# EasyEDA Pro project 15P1D_EDA.eprj

# Schematic SCH

## Sheets
1 P1: Board Name: B1; Create Date: 2024-03-08; Page Name: P1; Project Name: 15P1D_EDA; Schematic Name: SCH; Update Date: 2024-11-08; Company: EDA设计与开发; Page Size: A4; Version: V1.0
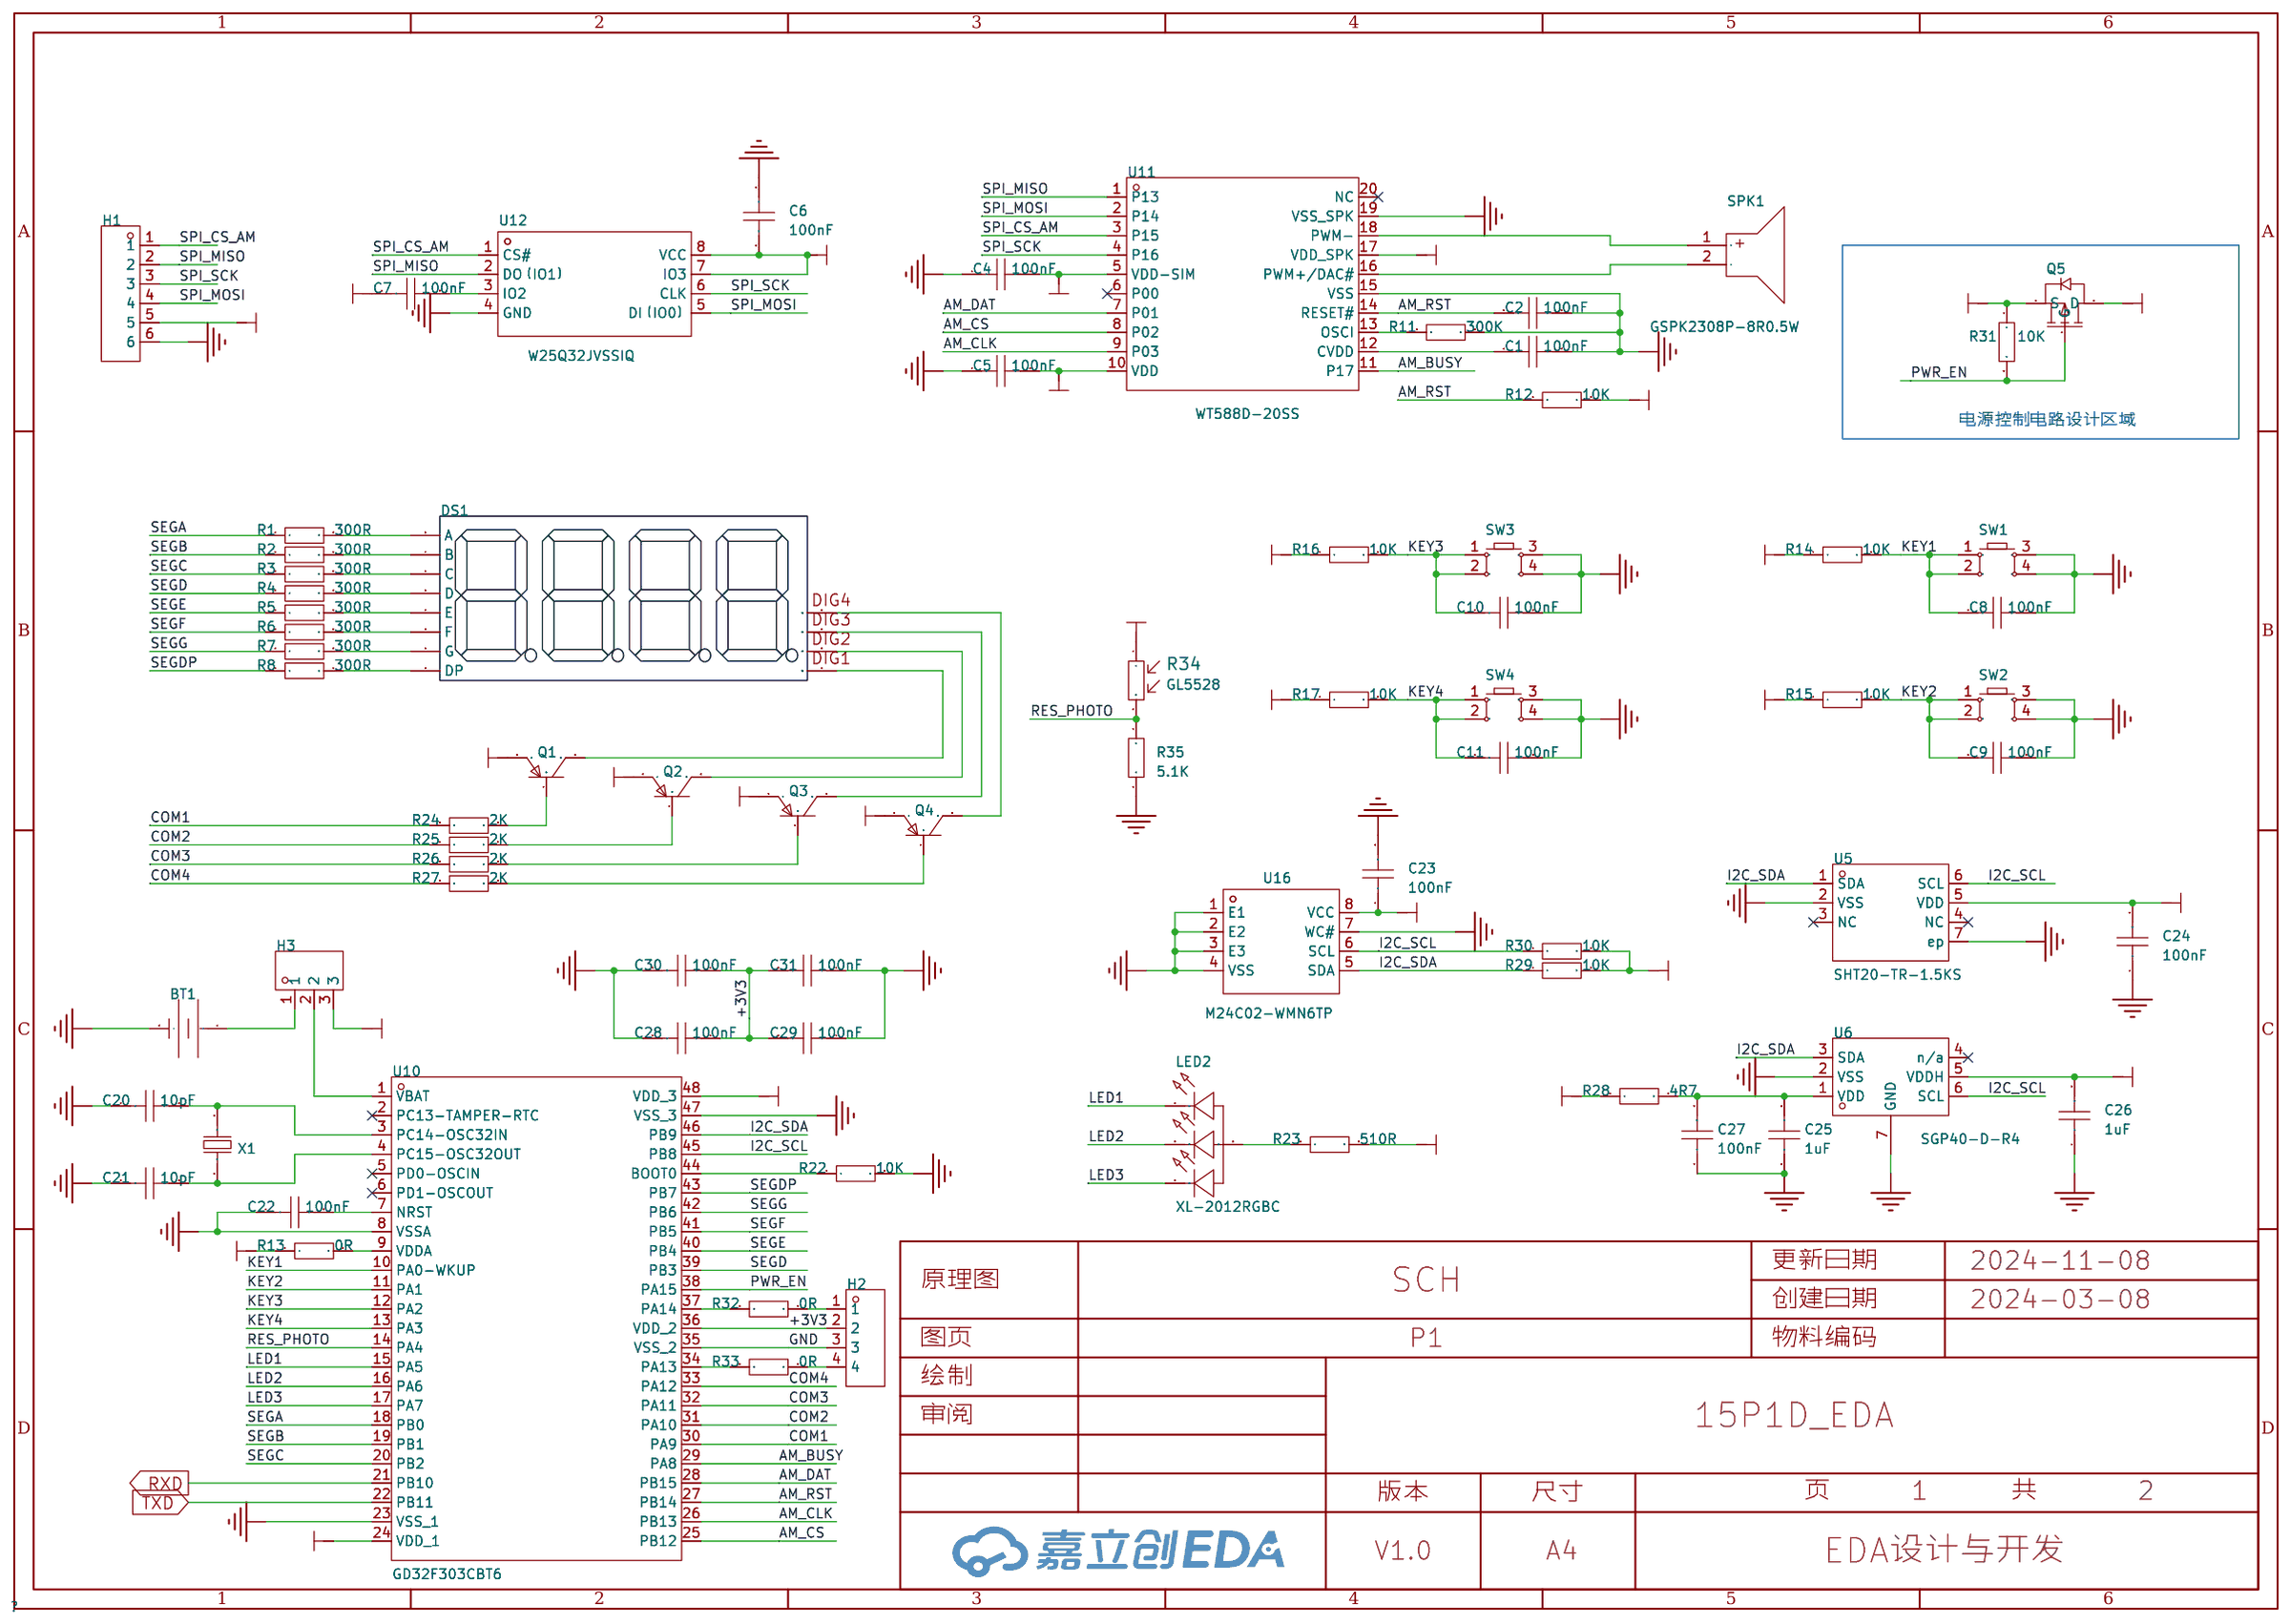
[diagram p0: P1]
2 P2: Create Date: 2024-03-12; Page Name: P2; Update Date: 2024-03-21; Company: 嘉立创EDA
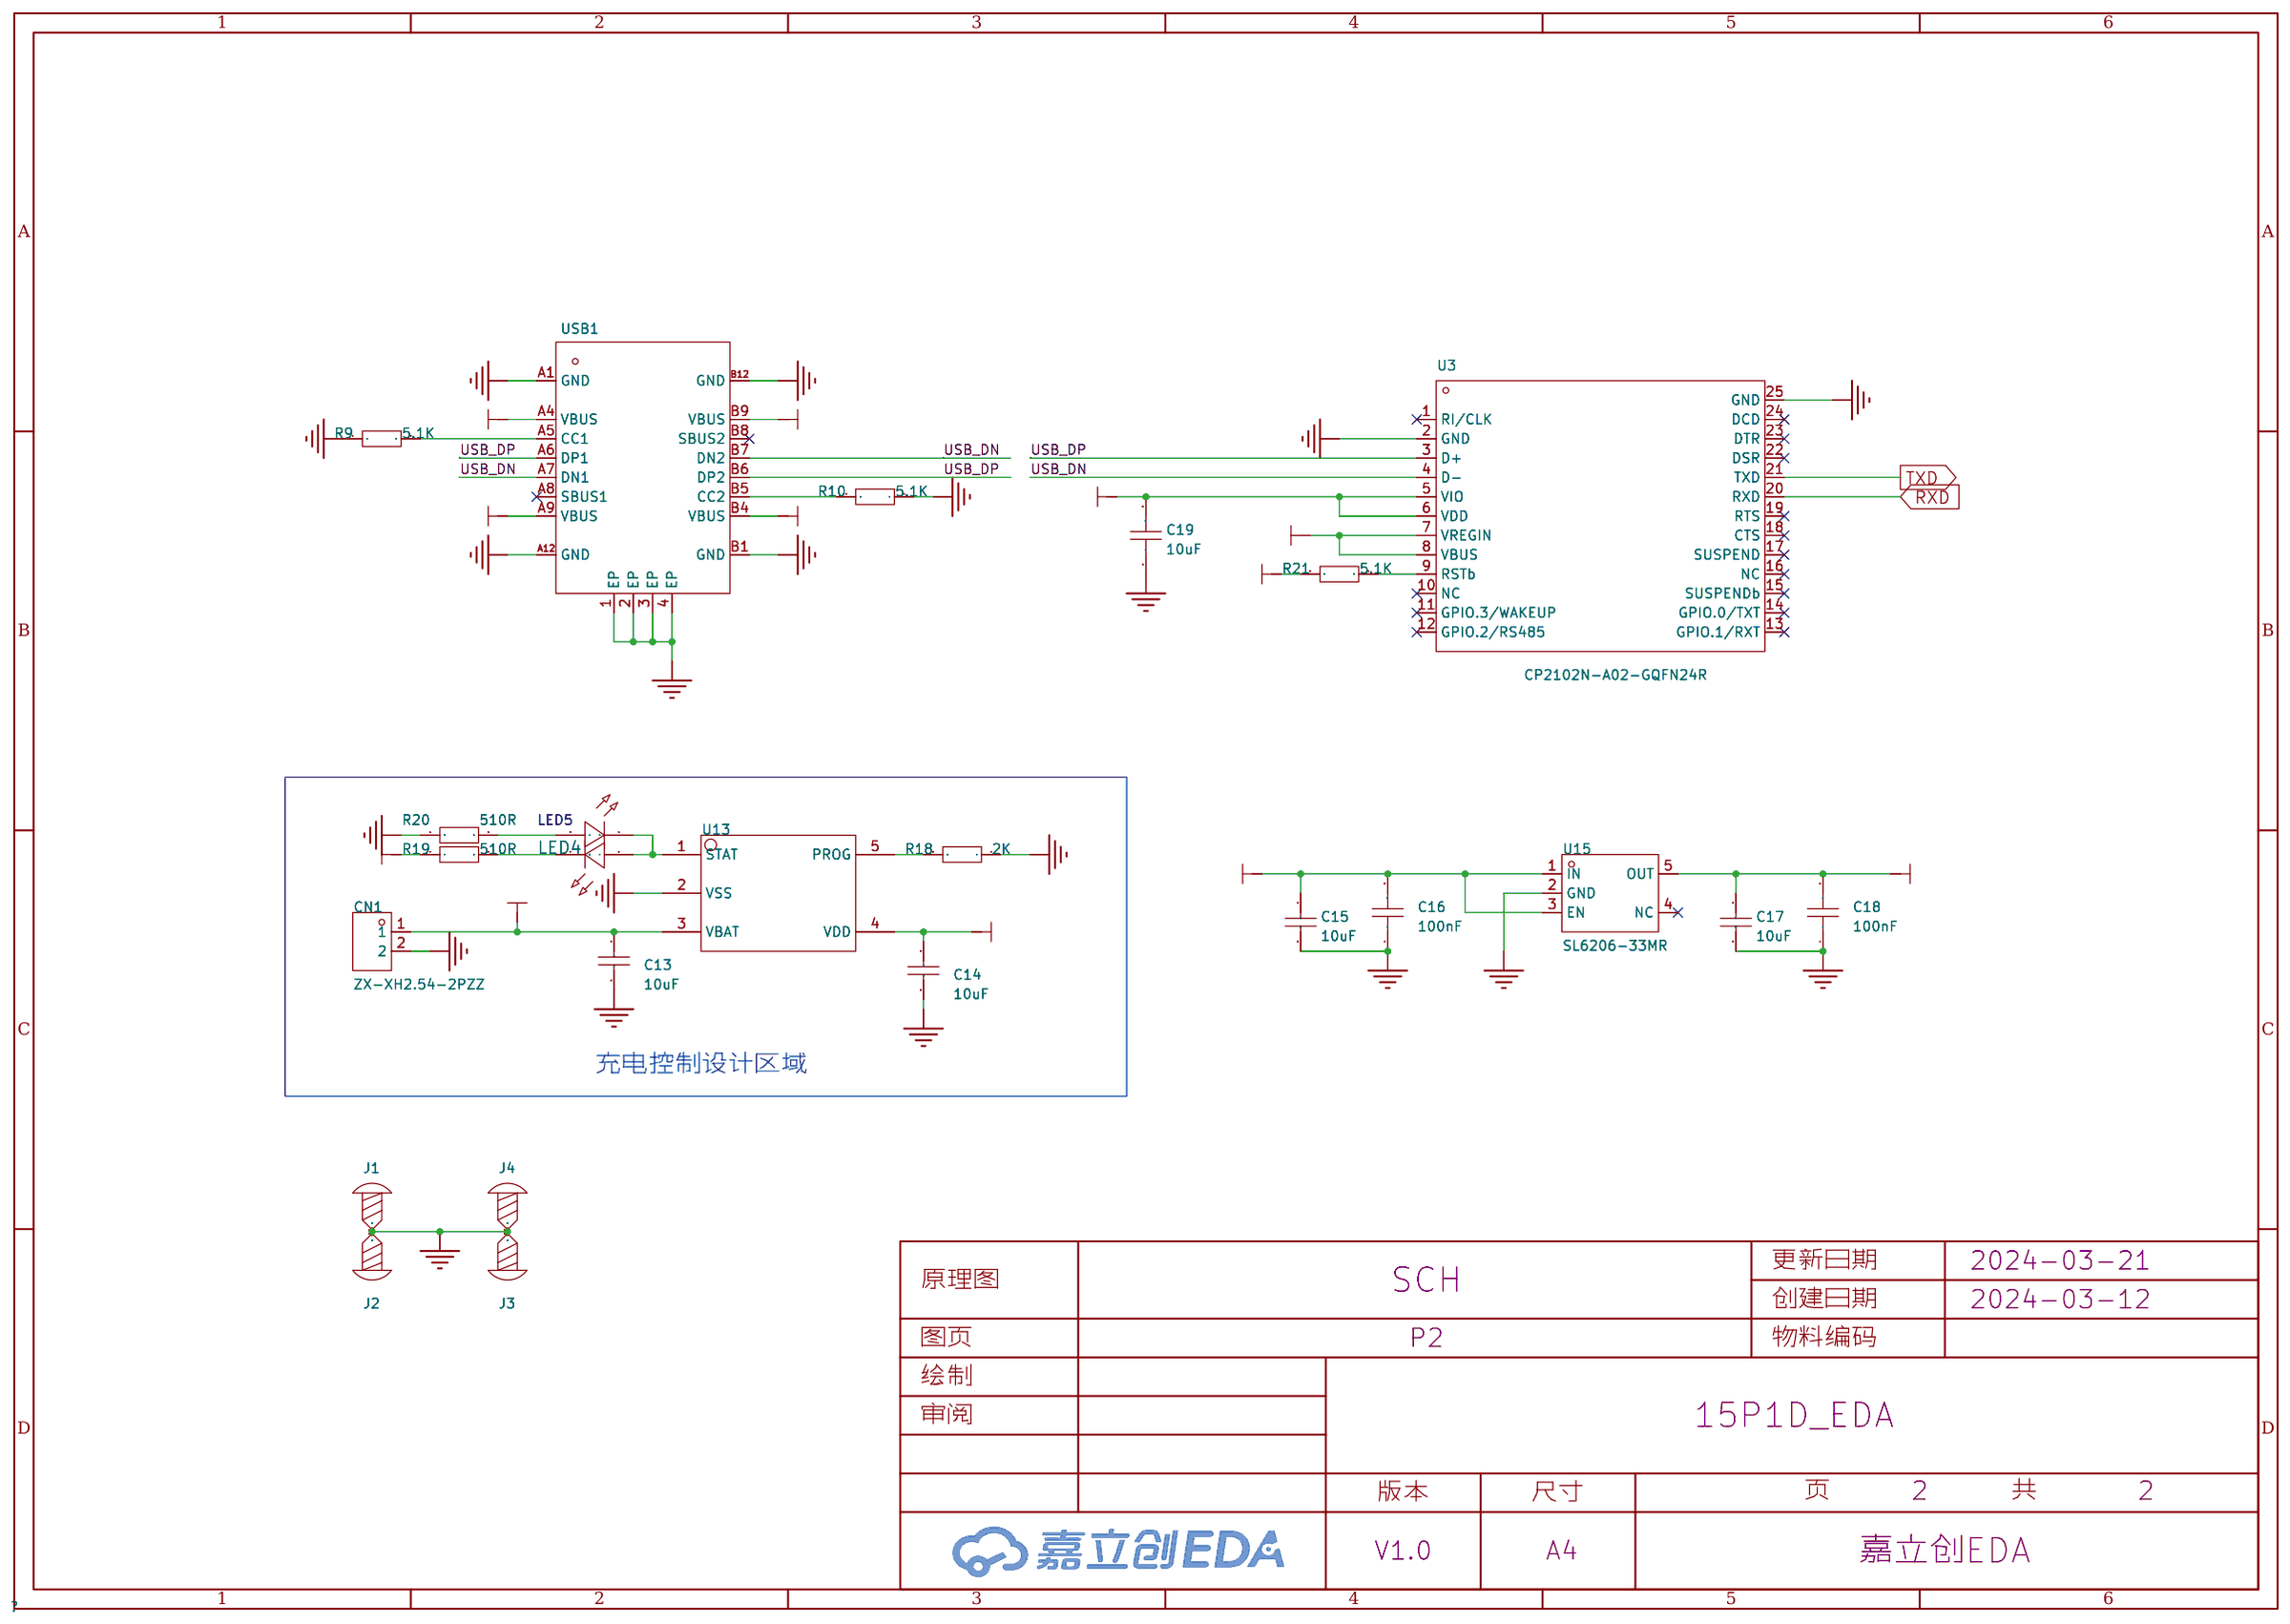
[diagram p1: P2]

## Parts
sheet P1
BT1  BS-12-B3AA003  [BAT-SMD_BS-12-B3AA011]
C1  100nF  [C0805]
C2  100nF  [C0805]
C4  100nF  [C0805]
C5  100nF  [C0805]
C6  100nF  [C0805]
C7  100nF  [C0805]
C8  100nF  [C0805]
C9  100nF  [C0805]
C10  100nF  [C0805]
C11  100nF  [C0805]
C20  10pF  [C0805]
C21  10pF  [C0805]
C22  100nF  [C0805]
C23  100nF  [C0805]
C24  100nF  [C0805]
C25  1uF  [C0805]
C26  1uF  [C0805]
C27  100nF  [C0805]
C28  100nF  [C0805]
C29  100nF  [C0805]
C30  100nF  [C0805]
C31  100nF  [C0805]
DS1  -  [LED-SEG-TH_FJ5461AH]
H1  -  [HDR-TH_6P-P2.54-V-F]
H2  -  [HDR-TH_4P-P2.54-V-F]
H3  Jumper3  [HDR-TH_3P-P2.54-V-M-A]
LED2  XL-2012RGBC  [LED-SMD_4P-L2.0-W1.3-BR]
Q1  -  [S8550P_SOT]
Q2  -  [S8550P_SOT]
Q3  -  [S8550P_SOT]
Q4  -  [S8550P_SOT]
Q5  -  [AO3401A_SOT-23-3]
R1  300R  [R0805]
R2  300R  [R0805]
R3  300R  [R0805]
R4  300R  [R0805]
R5  300R  [R0805]
R6  300R  [R0805]
R7  300R  [R0805]
R8  300R  [R0805]
R11  300K  [R0805]
R12  10K  [R0805]
R13  0R  [R0805]
R14  10K  [R0805]
R15  10K  [R0805]
R16  10K  [R0805]
R17  10K  [R0805]
R22  10K  [R0805]
R23  510R  [R0805]
R24  2K  [R0805]
R25  2K  [R0805]
R26  2K  [R0805]
R27  2K  [R0805]
R28  4R7  [R0805]
R29  10K  [R0805]
R30  10K  [R0805]
R31  10K  [R0805]
R32  0R  [R0805]
R33  0R  [R0805]
R34  GL5528  [RES-TH_L5.1-W4.3-P3.40-D0.5]
R35  5.1K  [R0805]
SPK1  GSPK2308P-8R0.5W  [SPK-TH_BD23.0-P10.00-D0.8-L-RD]
SW1  -  [Key_SMD_12x12x7.3]
SW2  -  [Key_SMD_12x12x7.3]
SW3  -  [Key_SMD_12x12x7.3]
SW4  -  [Key_SMD_12x12x7.3]
U5  SHT20-TR-1.5KS  [DFN-6_L3.0-W3.0-P0.95-TR-EP]
U6  SGP40-D-R4  [DFN-6_L2.4-W2.4-P0.80-TL-EP]
U10  GD32F303CBT6  [LQFP-48_L7.0-W7.0-P0.50-LS9.0-BL]
U11  WT588D-20SS  [SSOP-20_L7.2-W5.3-P0.65-LS7.8-BL]
U12  W25Q32JVSSIQ  [SOIC-8_L5.3-W5.3-P1.27-LS8.0-BL]
U16  M24C02-WMN6TP  [SOIC-8_L4.9-W3.9-P1.27-LS6.0-BL]
X1  32.768kHz  [FC-135R_L3.2-W1.5]
sheet P2
C13  10uF  [C1206]
C14  10uF  [C1206]
C15  10uF  [C1206]
C16  100nF  [C0805]
C17  10uF  [C1206]
C18  100nF  [C0805]
C19  10uF  [C0805]
CN1  ZX-XH2.54-2PZZ  [CONN-TH_2P-P2.50_HX25003-2A]
J1  -  [M2螺丝]
J2  -  [M2螺丝]
J3  -  [M2螺丝]
J4  -  [M2螺丝]
LED4  -  [LED_0805]
LED5  -  [LED_0805]
R9  5.1K  [R0805]
R10  5.1K  [R0805]
R18  2K  [R0805]
R19  510R  [R0805]
R20  510R  [R0805]
R21  5.1K  [R0805]
U3  CP2102N-A02-GQFN24R  [QFN-24_L4.0-W4.0-P0.50-TL-EP2.6]
U13  -  [SOP_BCON]
U15  SL6206-33MR  [SOT-23-5_L2.9-W1.6-P0.95-LS2.8-BL]
USB1  -  [USB_TYPE-C-16P]

## Library data of the parts
BT1 = BS-12-B3AA003: 连接器类型:电池底座;适用电池规格:CR1220;工作温度范围:-25℃~+85℃;; Supplier Part: C964723; Manufacturer: MYOUNG(美阳); Supplier Footprint: SMD; JLCPCB Part Class: 扩展库; Datasheet: https://atta.szlcsc.com/upload/public/pdf/source/20201218/C964723_733B638E287393F86295A2A4DAE43C75.pdf; Supplier: LCSC; Connector Type: 电池底座; Battery Type: CR1220; Operating Temperature Range: -25℃~+85℃
C1 C2 C4-C11 C16 C18-C31 = CAP_0805: Supplier Footprint: 0805
DS1 = LED_SEG_TH_0.56x4: Supplier Footprint: 插件
H1 = HDR-F_2.54_1x6P: Supplier Part: C40877; Supplier Footprint: 插件
H2 = HDR-F_2.54_1x4P: Supplier Part: C2718488; Supplier Footprint: 插件
H3 = Jumper3: Supplier Part: C2940050; Supplier Footprint: HDR-TH-3P-2.54mm; JLCPCB Part Class: 扩展库; Supplier: LCSC
LED2 = XL-2012RGBC: 发光颜色:RGB三色;功率:80mW；80mW；55mW;正向电流:25mA;主波长:619nm~624nm；463nm~466nm；524nm~527nm;二极管配置:-;透镜颜色:无色透明透镜;色温:-;发光角度:120°;载带方式:正贴;工作温度:-30℃~+85℃;; Supplier Part: C965848; Manufacturer: XINGLIGHT(成兴光); Supplier Footprint: 0805; JLCPCB Part Class: 扩展库; Datasheet: https://atta.szlcsc.com/upload/public/pdf/source/20221102/35E310354F68AE1BCFC07B93F5E395D6.pdf; Supplier: LCSC; Emitted Color: RGB三色; Power Dissipation: 80mW；80mW；55mW; Forward Current: 25mA; Dominant Wavelength: 619nm~624nm；463nm~466nm；524nm~527nm; Peak Wavelength: 624nm；528nm；469nm; Lens Color: 无色透明透镜; Viewing Angle: 120°; Mounting Sytle: 正贴; Operating Temperature: -30℃~+85℃
Q1-Q4 = S8550_SOT_PNP: Supplier Footprint: SOT-23
Q5 = AO3401A_P: Supplier Footprint: SOT-23-3L; Supplier Part: C15127
R1-R33 R35 = Res_0805: Supplier Footprint: 0805
R34 = GL5528: 暗电阻:1MΩ;亮电阻 @ 10Lux:8kΩ~20kΩ;光谱峰值(波长):540nm;; LCSC Part Name: 亮电阻:8kΩ~20kΩ 暗电阻:1MΩ; Supplier Part: C125627; Manufacturer: 森霸; Supplier Footprint: 插件,P=3mm; JLCPCB Part Class: 扩展库; Datasheet: https://atta.szlcsc.com/upload/public/pdf/source/20230427/842A99E3D53A83729D7968886D4EFCBB.pdf; Supplier: LCSC; Dark Resistance: 1MΩ; Illuminated Resistance @ 10Lux: 8kΩ~20kΩ; Applied Voltage: 150V; Spectral Peak: 540nm
SPK1 = GSPK2308P-8R0.5W: Supplier Part: C530532; Manufacturer: INGHAi(赢海); JLCPCB Part Class: 扩展库; Datasheet: https://atta.szlcsc.com/upload/public/pdf/source/20200723/C530532_3DB1F973601B36F20FBCCA52751811A3.pdf; Supplier: LCSC
SW1-SW4 = Key_SMD_12x12x7.3: Supplier Footprint: SMD
U5 = SHT20-TR-1.5KS: 接口类型:I2C;; LCSC Part Name: 1-100706-01; Supplier Part: C53865; Manufacturer: Sensirion(瑞士盛思锐); Supplier Footprint: DFN-6-EP(3x3); JLCPCB Part Class: 扩展库; Datasheet: https://atta.szlcsc.com/upload/public/pdf/source/20151012/1457707445424.pdf; Supplier: LCSC; Interface Type: I2C; Supply Voltage: 2.1V~3.6V
U6 = SGP40-D-R4: 气体类型:空气质量;精度:-;; LCSC Part Name: 3.000.384; Supplier Part: C2874215; Manufacturer: Sensirion(瑞士盛思锐); Supplier Footprint: DFN-6-EP(2.4x2.4); JLCPCB Part Class: 扩展库; Datasheet: https://atta.szlcsc.com/upload/public/pdf/source/20231011/67A6038984BE66B07B1FF2325C50691F.pdf; Supplier: LCSC; Type: 空气质量; Operating Temperature: -10℃~+50℃
U10 = GD32F303CBT6_C3013779: CPU内核:CM4;程序存储容量:128KB;RAM总容量:32KB;GPIO端口数量:37;工作电压范围:-;CPU最大主频:120MHz;程序存储器类型:FLASH;; Supplier Part: C3013779; Manufacturer: GigaDevice(兆易创新); Supplier Footprint: LQFP-48(7x7); JLCPCB Part Class: 扩展库; Datasheet: https://atta.szlcsc.com/upload/public/pdf/source/20220624/E1A57ED816B162D6D1424864911A792F.pdf; Supplier: LCSC; CPU Core: CM4; Program Storage Size: 128KB; RAM Size: 32KB; GPIO Ports Number: 37; CPU Maximum Speed: 120MHz; Program Memory Type: FLASH; ADC (Bit): 12bit; DAC (Bit): 12bit; 16Bit Timer: 7; CAN: 1; UART/USART: 3; I2C: 2; I2S: 2; SPI: 3; Peripheral/Function: 看门狗；RTC实时时钟; Watchdog: 有; Real-Time Clock: 有
U11 = WT588D-20SS: 高品质语音芯片; Supplier Part: C87498; Manufacturer: WT(唯创知音); Supplier Footprint: SSOP-20-208mil; JLCPCB Part Class: 扩展库; Datasheet: https://atta.szlcsc.com/upload/public/pdf/source/20161217/1481939141189.pdf; Supplier: LCSC
U12 = W25Q32JVSSIQ_C82344: 接口类型:SPI;存储容量:32Mbit;; Supplier Part: C82344; Manufacturer: WINBOND(华邦); Supplier Footprint: SOIC-8-208mil; JLCPCB Part Class: 扩展库; Datasheet: https://atta.szlcsc.com/upload/public/pdf/source/20160910/1473490310454.pdf; Supplier: LCSC; Interface Type: SPI; Memory Size: 32Mbit; Supply Voltage: 2.7V~3.6V; Page Programming Time (Tpp): 3ms; Operating Temperature: -40℃~+85℃
U16 = M24C02-WMN6TP: 接口类型:I2C;存储容量:2Kbit;; Supplier Part: C7562; Manufacturer: ST(意法半导体); Supplier Footprint: SOIC-8; JLCPCB Part Class: Extended Part; Datasheet: https://atta.szlcsc.com/upload/public/pdf/source/20140724/1457707167301.pdf; Supplier: LCSC; Interface Type: I2C; Memory Size: 2Kbit; Supply Voltage: 2.5V~5.5V; Operating Temperature: -40℃~+85℃
X1 = Q13FC13500004_C32346: 晶振类型:贴片晶振;频率:32.768kHz;常温频差:±20ppm;外接负载电容:12.5pF;; LCSC Part Name: 32.768kHz ±20ppm 12.5pF; Supplier Part: C32346; Manufacturer: EPSON(爱普生); Manufacturer Part: Q13FC13500004; Supplier Footprint: SMD3215-2P; JLCPCB Part Class: 基础库; Datasheet: https://atta.szlcsc.com/upload/public/pdf/source/20190108/C32346_746D6B07EAF90824457A96480007685F.pdf; Supplier: LCSC; Crystal Type: 贴片晶振; Normal temperature Frequency Tolerance: ±20ppm; External load capacitor: 12.5pF; Equivalent Series Resistance (ESR): 70kΩ; Operating Temperature: -40℃~+85℃
C13-C15 C17 = CL31A106KBHNNNE: 容值:10uF;精度:±10%;额定电压:50V;材质(温度系数):X5R;; LCSC Part Name: 10uF ±10% 50V; Supplier Part: C13585; Manufacturer: SAMSUNG(三星); Supplier Footprint: 1206; JLCPCB Part Class: 基础库; Datasheet: https://atta.szlcsc.com/upload/public/pdf/source/20160218/1457707763339.pdf; Supplier: LCSC; Tolerance: ±10%; Voltage Rated: 50V; Temperature Coefficient: X5R
CN1 = ZX-XH2.54-2PZZ: 插针结构:1x2P;间距:2.54mm;安装方式:直插;参考系列:XH;总PIN数:2P;排数:1;每排PIN数:2;行距:-;额定电流:3A;触头材质:黄铜;触头镀层:锡;工作温度范围:-25℃~+85℃;; Supplier Part: C7429632; Manufacturer: Megastar(兆星); Supplier Footprint: 插件,P=2.54mm; JLCPCB Part Class: 扩展库; Datasheet: https://atta.szlcsc.com/upload/public/pdf/source/20230619/19BA6947230AA44A04D3EDD65E618FD0.pdf; Supplier: LCSC; Pins Structure: 1x2P; Pitch: 2.54mm; Mounting Style: 直插; Reference Series: XH; Number of Pins: 2P; Number of Rows: 1; Number of PINs Per Row: 2; Current Rating (Max): 3A; Contact Material: 黄铜; Contact Plating: 锡; Operating Temperature Range: -25℃~+85℃
J1-J4 = M2螺丝: Supplier Footprint: 插件
LED4 = LED_0805-R: Supplier Footprint: 0805
LED5 = LED_0805-G: Supplier Footprint: 0805
U3 = CP2102N-A02-GQFN24R: 应用功能:USB转UART;接口协议:UART;; Supplier Part: C969151; Manufacturer: SKYWORKS/SILICON LABS(芯科); Supplier Footprint: QFN-24-EP(4x4); JLCPCB Part Class: 扩展库; Datasheet: https://atta.szlcsc.com/upload/public/pdf/source/20201204/C964632_F2B790CC23A72455AEF523510305B30A.pdf; Supplier: LCSC; Applications Function: USB转UART; Protocol: UART; Supply Voltage: 3V~3.6V; Operating Temperature: -40℃~+85℃@(Ta)
U13 = BCON
U15 = SL6206-33MR: 输出类型:-;; Supplier Part: C707122; Manufacturer: Slkor(萨科微); Supplier Footprint: SOT-23-5; JLCPCB Part Class: 扩展库; Datasheet: https://atta.szlcsc.com/upload/public/pdf/source/20200721/C707121_33633D17E61D5DC97F22208BE63A0FB1.pdf; Supplier: LCSC
USB1 = USB_TYPE-C-16P: Supplier Footprint: SMD

## Nets
+3V3: C4.2 C5.2 C6.2 C7.1 C17.2 C18.2 C19.2 C23.1 C28.1 C29.2 C30.1 C31.2 H1.5 H2.2 H3.3 Q1.2(E) Q2.2(E) Q3.2(E) Q4.2(E) Q5.2(S) R12.2 R13.1 R14.1 R15.1 R16.1 R17.1 R21.2 R23.2 R29.2 R30.2 R31.1 R34.1 U3.5(VIO) U3.6(VDD) U10.24(VDD_1) U10.36(VDD_2) U10.48(VDD_3) U11.5(VDD-SIM) U11.10(VDD) U11.17(VDD_SPK) U12.7(IO3) U12.8(VCC) U15.5(OUT) U16.8(VCC)
GND: BT1.2(-) C1.2 C2.2 C4.1 C5.1 C6.1 C8.2 C9.2 C10.2 C11.2 C13.2 C14.1 C15.1 C16.1 C17.1 C18.1 C19.1 C20.1 C21.1 C22.1 C23.2 C24.1 C25.1 C26.1 C27.1 C28.2 C29.1 C30.2 C31.1 CN1.2 H1.6 H2.3 J1.1 J2.1 J3.1 J4.1 R9.1 R10.1 R11.2 R18.1 R20.1 R22.2 R35.2 SW1.3 SW1.4 SW2.3 SW2.4 SW3.3 SW3.4 SW4.3 SW4.4 U3.2(GND) U3.25(GND) U5.2(VSS) U5.7(ep) U6.2(VSS) U6.7(GND) U10.8(VSSA) U10.23(VSS_1) U10.35(VSS_2) U10.47(VSS_3) U11.15(VSS) U11.19(VSS_SPK) U12.4(GND) U13.2(VSS) U15.2(GND) U16.1(E1) U16.2(E2) U16.3(E3) U16.4(VSS) U16.7(WC#) USB1.1(EP) USB1.2(EP) USB1.3(EP) USB1.4(EP) USB1.A1(GND) USB1.A12(GND) USB1.B1(GND) USB1.B12(GND)
VBAT: C13.1 C15.2 C16.2 CN1.1 U13.3(VBAT) U15.1(IN) U15.3(EN)
VBUS: C14.2 R19.1 U3.7(VREGIN) U3.8(VBUS) U13.4(VDD) USB1.A4(VBUS) USB1.A9(VBUS) USB1.B4(VBUS) USB1.B9(VBUS)
+VS: C24.2 C26.2 Q5.3(D) R28.1 U5.5(VDD) U6.5(VDDH)
AM_BUSY: U10.29(PA8) U11.11(P17)
AM_CLK: U10.26(PB13) U11.9(P03)
AM_CS: U10.25(PB12) U11.8(P02)
AM_DAT: U10.28(PB15) U11.7(P01)
AM_RST: C2.1 R12.1 U10.27(PB14) U11.14(RESET#)
COM1: R24.1 U10.30(PA9)
COM2: R25.1 U10.31(PA10)
COM3: R26.1 U10.32(PA11)
COM4: R27.1 U10.33(PA12)
I2C_SCL: R30.1 U5.6(SCL) U6.6(SCL) U10.45(PB8) U16.6(SCL)
I2C_SDA: R29.1 U5.1(SDA) U6.3(SDA) U10.46(PB9) U16.5(SDA)
KEY1: C8.1 R14.2 SW1.1 SW1.2 U10.10(PA0-WKUP)
KEY2: C9.1 R15.2 SW2.1 SW2.2 U10.11(PA1)
KEY3: C10.1 R16.2 SW3.1 SW3.2 U10.12(PA2)
KEY4: C11.1 R17.2 SW4.1 SW4.2 U10.13(PA3)
LED1: LED2.1 U10.15(PA5)
LED2: LED2.2 U10.16(PA6)
LED3: LED2.4 U10.17(PA7)
PWR_EN: Q5.1(G) R31.2 U10.38(PA15)
RES_PHOTO: R34.2 R35.1 U10.14(PA4)
RXD: U3.20(RXD) U10.21(PB10)
SEGA: R1.1 U10.18(PB0)
SEGB: R2.1 U10.19(PB1)
SEGC: R3.1 U10.20(PB2)
SEGD: R4.1 U10.39(PB3)
SEGDP: R8.1 U10.43(PB7)
SEGE: R5.1 U10.40(PB4)
SEGF: R6.1 U10.41(PB5)
SEGG: R7.1 U10.42(PB6)
SPI_CS_AM: H1.1 U11.3(P15) U12.1(CS#)
SPI_MISO: H1.2 U11.1(P13) U12.2(DO（IO1）)
SPI_MOSI: H1.4 U11.2(P14) U12.5(DI（IO0）)
SPI_SCK: H1.3 U11.4(P16) U12.6(CLK)
TXD: U3.21(TXD) U10.22(PB11)
USB_DN: U3.4(D-) USB1.A7(DN1) USB1.B7(DN2)
USB_DP: U3.3(D+) USB1.A6(DP1) USB1.B6(DP2)
$1N1449: DS1.8(DIG3) Q3.3(C)
$1N1467: DS1.1(E) R5.2
$1N1471: DS1.2(D) R4.2
$1N1475: DS1.3(DP) R8.2
$1N1479: DS1.4(C) R3.2
$1N1483: DS1.5(G) R7.2
$1N1487: DS1.11(A) R1.2
$1N1491: DS1.7(B) R2.2
$1N1495: DS1.10(F) R6.2
$1N6161: C1.1 U11.12(CVDD)
$1N6192: R11.1 U11.13(OSCI)
$1N6375: SPK1.1(+) U11.18(PWM-)
$1N6384: SPK1.2(-) U11.16(PWM+/DAC#)
$1N6917: C7.2 U12.3(IO2)
$1N7212: R13.2 U10.9(VDDA)
$1N7925: C20.2 U10.3(PC14-OSC32IN) X1.1
$1N7930: C21.2 U10.4(PC15-OSC32OUT) X1.2
$1N8028: R22.1 U10.44(BOOT0)
$1N8104: LED2.3 R23.1
$1N8256: DS1.12(DIG1) Q1.3(C)
$1N8335: DS1.9(DIG2) Q2.3(C)
$1N8343: DS1.6(DIG4) Q4.3(C)
$1N8477: Q1.1(B) R24.2
$1N8481: Q2.1(B) R25.2
$1N8485: Q3.1(B) R26.2
$1N8489: Q4.1(B) R27.2
$1N8598: C22.2 U10.7(NRST)
$1N9384: C25.2 C27.2 R28.2 U6.1(VDD)
$1N9794: R32.1 U10.37(PA14)
$1N9795: H2.1 R32.2
$1N9824: R33.1 U10.34(PA13)
$1N9825: H2.4 R33.2
$1N10132: BT1.1(+) H3.1
$1N10135: H3.2 U10.1(VBAT)
$2N394: R9.2 USB1.A5(CC1)
$2N397: R10.2 USB1.B5(CC2)
$2N1836: R21.1 U3.9(RSTb)
$2N7002: LED4.2(A) LED5.1(C) U13.1(STAT)
$2N7018: LED5.2(A) R20.2
$2N7022: LED4.1(C) R19.2
$2N7090: R18.2 U13.5(PROG)

Not connected (* = marked no-connect by the designer): U3 1(RI/CLK)* 10(NC)* 11(GPIO.3/WAKEUP)* 12(GPIO.2/RS485)* 13(GPIO.1/RXT)* 14(GPIO.0/TXT)* 15(SUSPENDb)* 16(NC)* 17(SUSPEND)* 18(CTS)* 19(RTS)* 22(DSR)* 23(DTR)* 24(DCD)*; U5 3(NC)* 4(NC)*; U6 4(n/a)*; U10 2(PC13-TAMPER-RTC)* 5(PD0-OSCIN)* 6(PD1-OSCOUT)*; U11 6(P00)* 20(NC)*; U15 4(NC)*; USB1 A8(SBUS1)* B8(SBUS2)*

## Notes on the sheets
sheet 1
- 电源控制电路设计区域
sheet 2
- 充电控制设计区域

# Board PCB
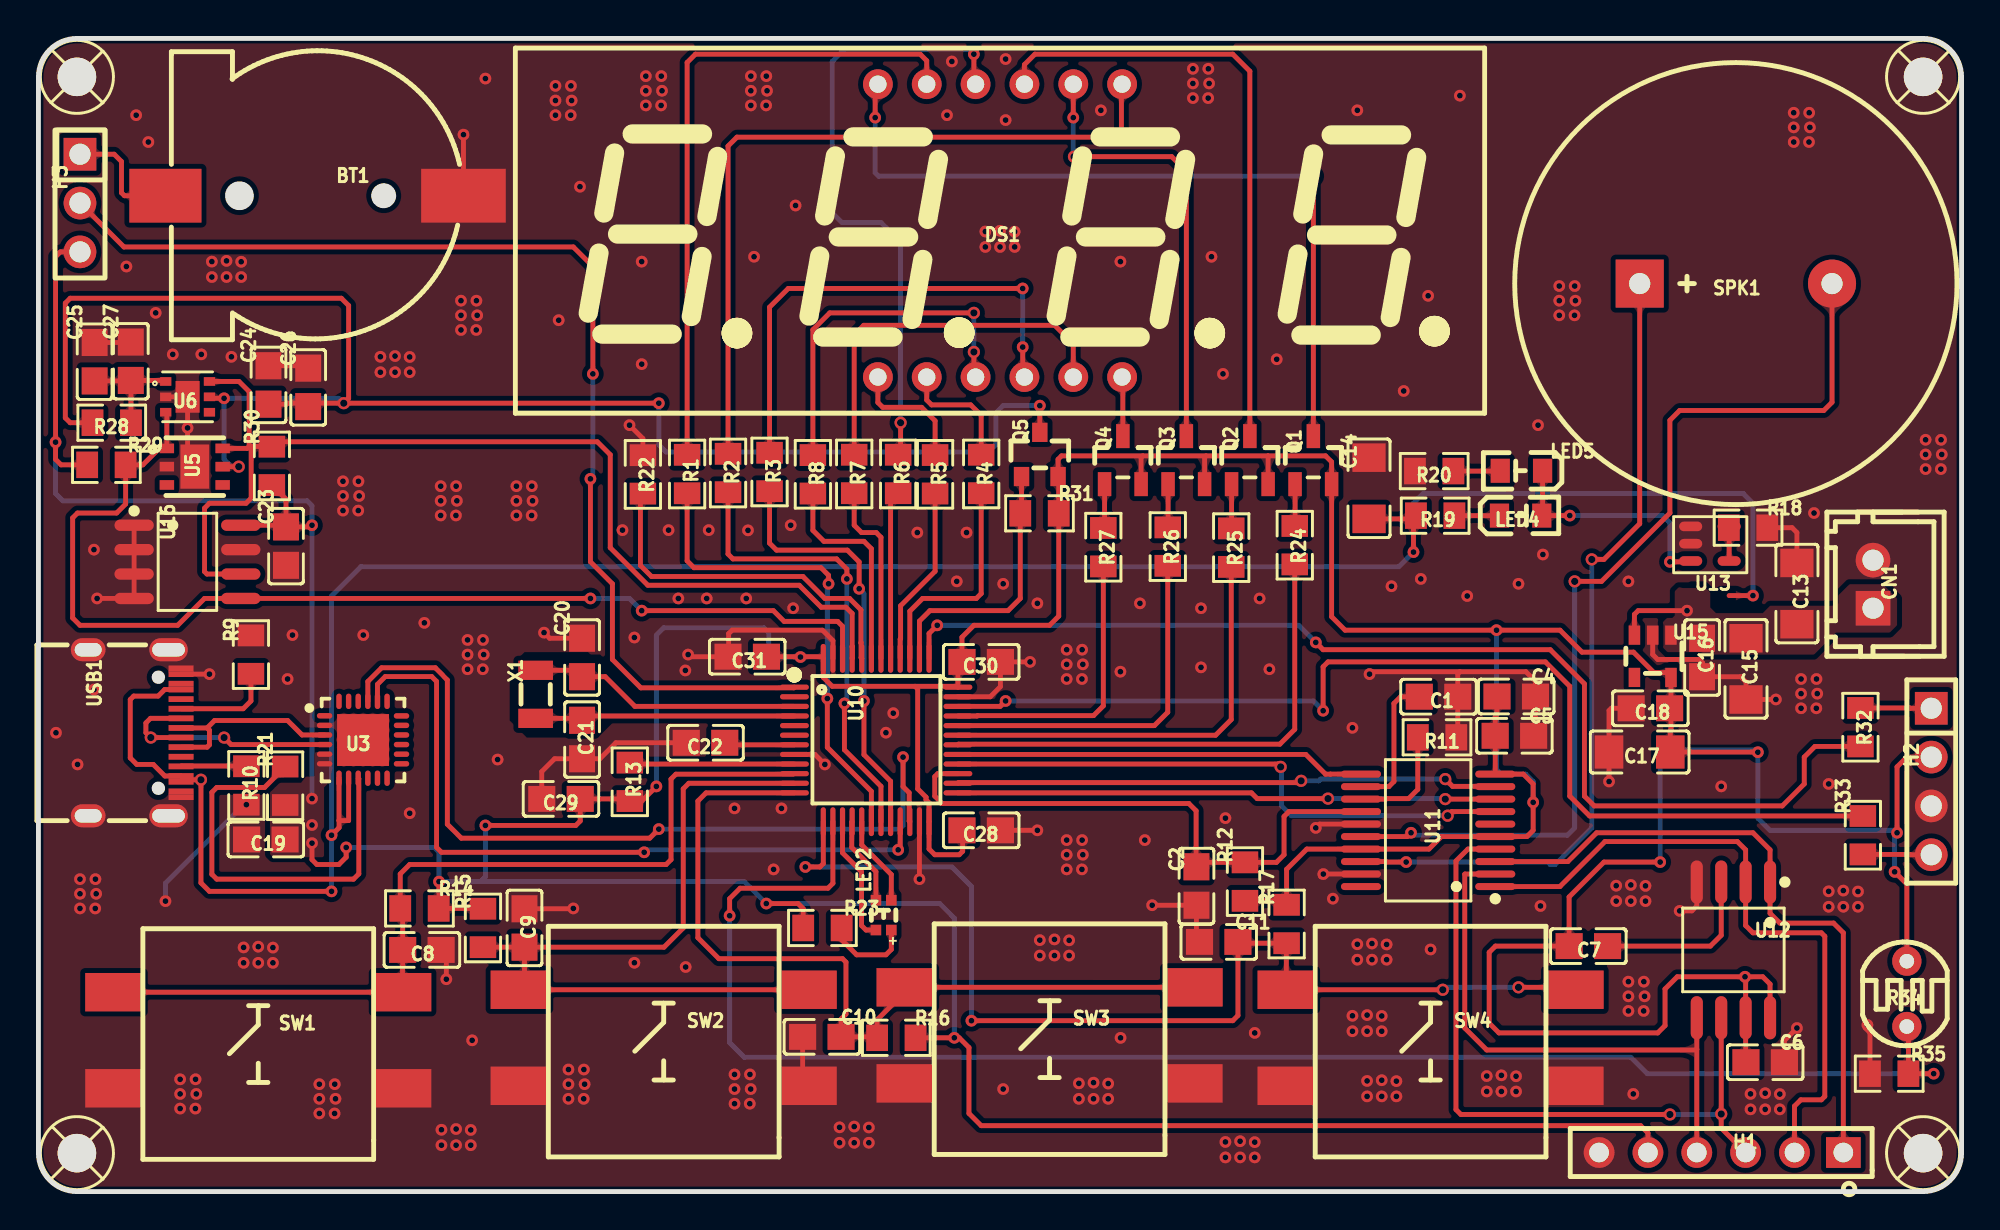
[diagram p2: board, top side]
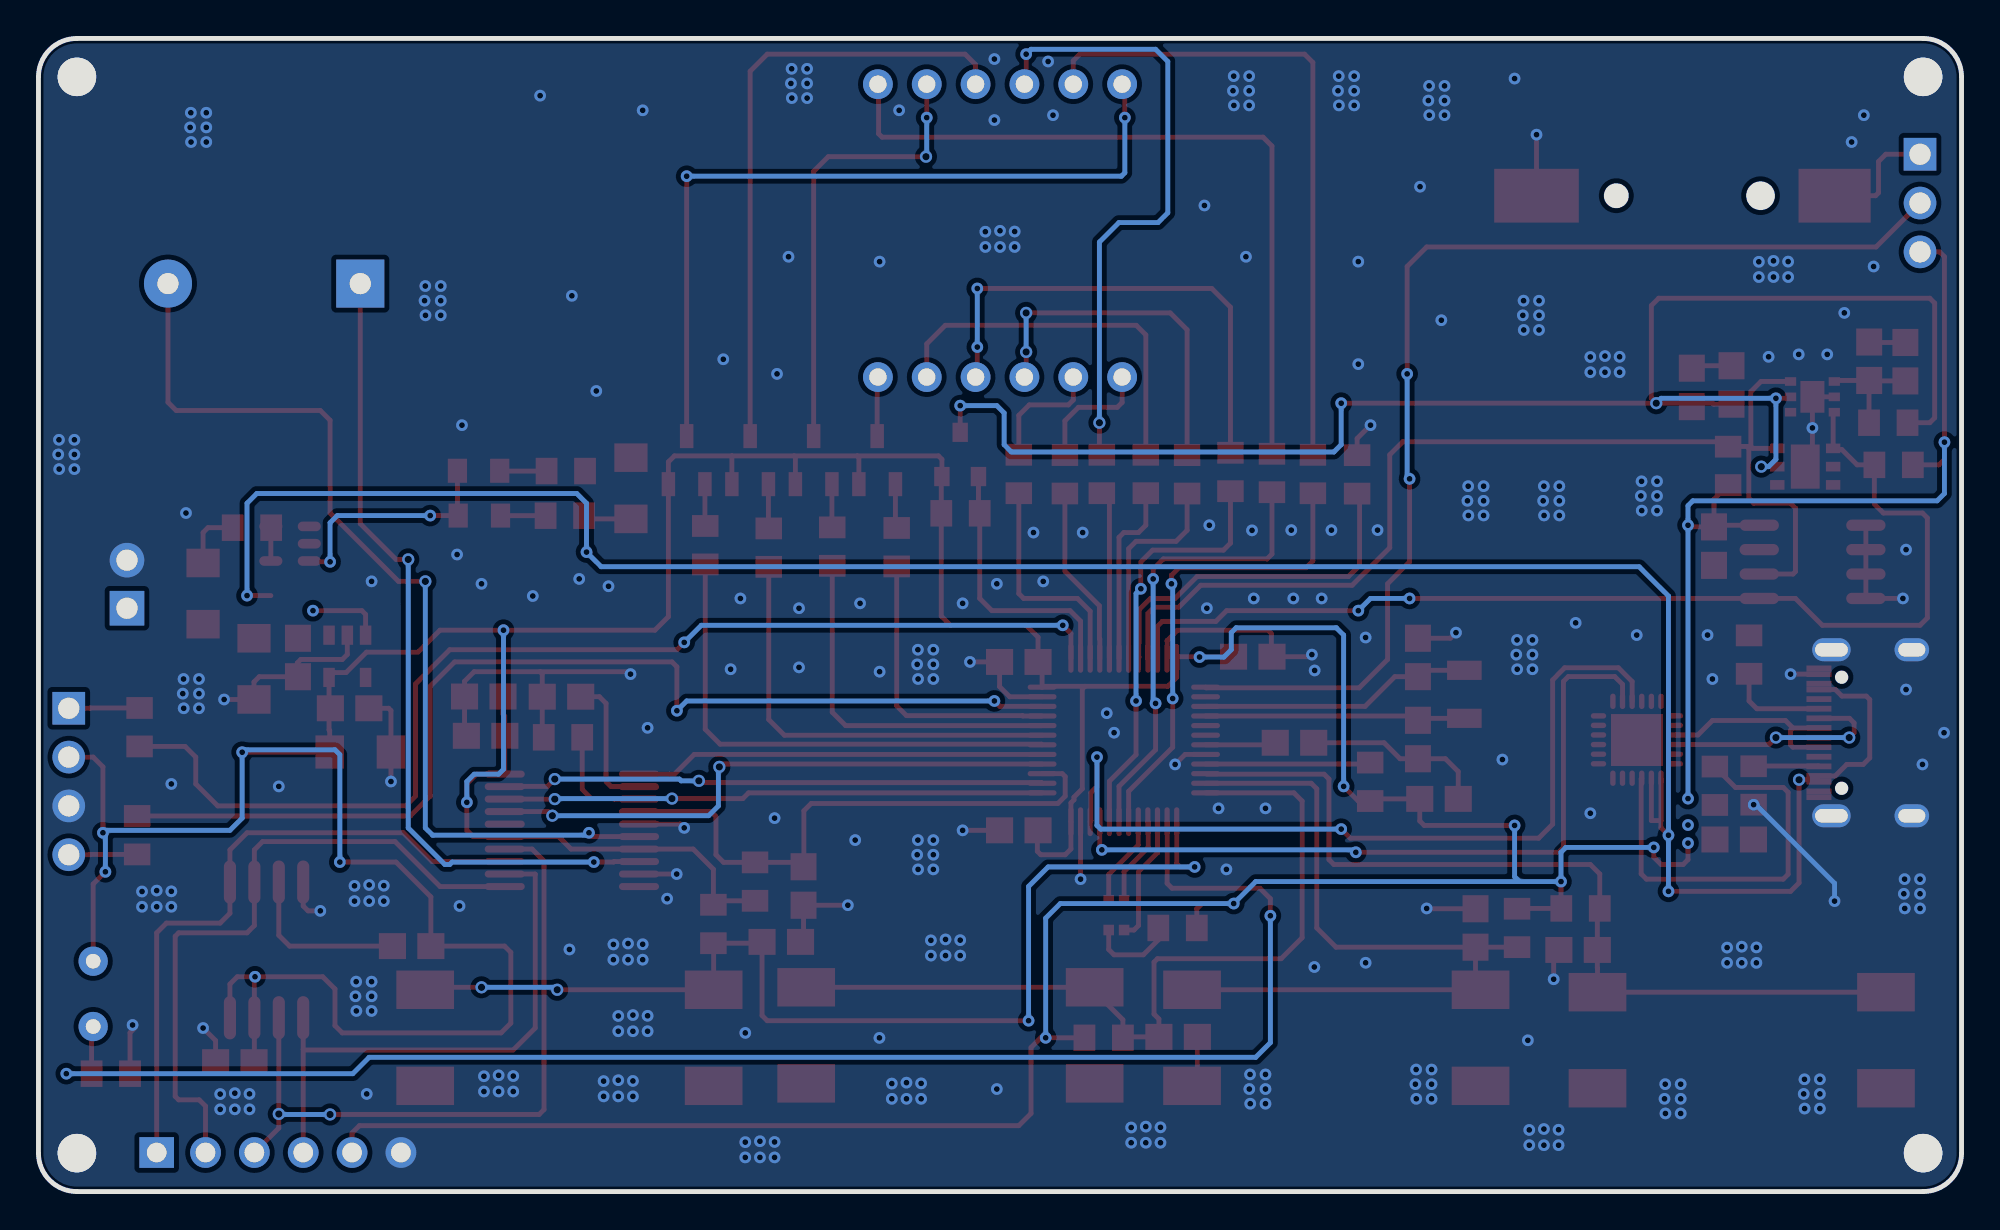
[diagram p3: board, bottom side, seen from below]

Outline 100 x 60 mm; copper layers: Top Layer, Bottom Layer. Coordinates in mm from the lower left corner of the outline.
Outline path: 0,58 0,2 arc(0.59,0.59) 2,0 98,0 arc(99.41,0.59) 100,2 100,58 arc(99.41,59.41) 98,60 2,60 arc(0.59,59.41) 0,58
Stack: Top Layer 0.035mm / Dielectric1 1.51mm FR4 er 4.5 / Bottom Layer 0.035mm

## Design rules (mm)
template: 自定义配置
spacing copperThickness1oz (default): track to track 0.203, other pairs 0.178 to 0.203
spacing copperThickness2oz: track to track 0.203, other pairs 0.152 to 0.3
track width copperThickness1oz (default): min 0.254, default 0.254, max 2.54
track width copperThickness2oz: min 0.203, default 0.254, max 2.54
differential pair differentialPair (default): width min 0.127, default 0.254, max 2.54; gap min 0.152, default 0.152
via viaSize (default): diameter min 0.61, default 0.61, max 0.635; hole min 0.305, default 0.305, max 0.381

## Placement (name value [footprint] x y rotation side)
BT1  BS-12-B3AA003  [BAT-SMD_BS-12-B3AA011]  14.35 51.82 180 top
C1  100nF  [C0805]  72.8 25.75 0 top
C2  100nF  [C0805]  60.22 15.9 270 top
C4  100nF  [C0805]  76.84 25.76 180 top
C5  100nF  [C0805]  76.75 23.72 180 top
C6  100nF  [C0805]  89.79 6.73 180 top
C7  100nF  [C0805]  80.59 12.77 0 top
C8  100nF  [C0805]  19.94 12.57 0 top
C9  100nF  [C0805]  25.27 13.72 90 top
C10  100nF  [C0805]  40.74 8.05 180 top
C11  100nF  [C0805]  61.37 12.99 180 top
C13  10uF  [C1206]  91.44 31.11 90 top
C14  10uF  [C1206]  69.19 36.59 270 top
C15  10uF  [C1206]  88.79 27.2 90 top
C16  100nF  [C0805]  86.51 27.79 90 top
C17  10uF  [C1206]  83.26 22.87 0 top
C18  100nF  [C0805]  83.82 25.15 0 top
C19  10uF  [C0805]  11.82 18.32 0 top
C20  10pF  [C0805]  28.27 27.79 270 top
C21  10pF  [C0805]  28.27 23.52 90 top
C22  100nF  [C0805]  34.69 23.35 0 top
C23  100nF  [C0805]  12.87 33.58 270 top
C24  100nF  [C0805]  11.96 41.97 270 top
C25  1uF  [C0805]  2.92 43.18 270 top
C26  1uF  [C0805]  14.03 41.84 270 top
C27  100nF  [C0805]  4.8 43.2 270 top
C28  100nF  [C0805]  49.02 18.8 0 top
C29  100nF  [C0805]  27.17 20.43 0 top
C30  100nF  [C0805]  49.02 27.56 0 top
C31  100nF  [C0805]  36.86 27.83 0 top
CN1  ZX-XH2.54-2PZZ  [CONN-TH_2P-P2.50_HX25003-2A]  95.4 31.6 90 top
DS1  -  [LED-SEG-TH_FJ5461AH]  50 50 0 top
H1  -  [HDR-TH_6P-P2.54-V-F]  87.5 2.03 180 top
H2  -  [HDR-TH_4P-P2.54-V-F]  98.43 21.34 270 top
H3  Jumper3  [HDR-TH_3P-P2.54-V-M-A]  2.16 51.44 270 top
J1  -  [M2螺丝]  2 2 0 top
J2  -  [M2螺丝]  98 2 0 top
J3  -  [M2螺丝]  98 58 0 top
J4  -  [M2螺丝]  2 58 0 top
LED2  XL-2012RGBC  [LED-SMD_4P-L2.0-W1.3-BR]  43.95 14.38 270 top
LED4  -  [LED_0805]  77.12 35.17 0 top
LED5  -  [LED_0805]  77.06 37.51 180 top
Q1  -  [S8550P_SOT]  66.29 38.1 270 top
Q2  -  [S8550P_SOT]  62.99 38.1 270 top
Q3  -  [S8550P_SOT]  59.69 38.1 270 top
Q4  -  [S8550P_SOT]  56.39 38.1 270 top
Q5  -  [AO3401A_SOT-23-3]  52.07 38.35 270 top
R1  300R  [R0805]  33.73 37.33 90 top
R2  300R  [R0805]  35.86 37.39 90 top
R3  300R  [R0805]  38.02 37.44 90 top
R4  300R  [R0805]  49.02 37.34 90 top
R5  300R  [R0805]  46.62 37.32 90 top
R6  300R  [R0805]  44.7 37.34 90 top
R7  300R  [R0805]  42.42 37.34 90 top
R8  300R  [R0805]  40.27 37.32 90 top
R9  5.1K  [R0805]  11.05 27.94 270 top
R10  5.1K  [R0805]  10.81 21.13 90 top
R11  300K  [R0805]  72.72 23.63 0 top
R12  10K  [R0805]  62.74 16.13 270 top
R13  0R  [R0805]  30.75 21.32 90 top
R14  10K  [R0805]  19.81 14.73 180 top
R15  10K  [R0805]  23.11 13.72 270 top
R16  10K  [R0805]  44.61 8 180 top
R17  10K  [R0805]  64.9 13.92 270 top
R18  2K  [R0805]  88.9 34.54 180 top
R19  510R  [R0805]  72.63 35.17 0 top
R20  510R  [R0805]  72.58 37.49 0 top
R21  5.1K  [R0805]  12.83 21.11 270 top
R22  10K  [R0805]  31.43 37.32 90 top
R23  510R  [R0805]  40.77 13.72 180 top
R24  2K  [R0805]  65.33 33.63 90 top
R25  2K  [R0805]  62.03 33.51 90 top
R26  2K  [R0805]  58.72 33.56 90 top
R27  2K  [R0805]  55.37 33.53 90 top
R28  4R7  [R0805]  3.81 40 0 top
R29  10K  [R0805]  3.53 37.81 180 top
R30  10K  [R0805]  12.14 37.76 270 top
R31  10K  [R0805]  52.05 35.29 180 top
R32  0R  [R0805]  94.74 24.16 90 top
R33  0R  [R0805]  94.87 18.54 270 top
R34  GL5528  [RES-TH_L5.1-W4.3-P3.40-D0.5]  97.16 10.29 0 top
R35  5.1K  [R0805]  96.24 6.13 180 top
SPK1  GSPK2308P-8R0.5W  [SPK-TH_BD23.0-P10.00-D0.8-L-RD]  88.26 47.24 0 top
SW1  -  [Key_SMD_12x12x7.3]  11.43 7.87 180 top
SW2  -  [Key_SMD_12x12x7.3]  32.51 8 180 top
SW3  -  [Key_SMD_12x12x7.3]  52.58 8.13 180 top
SW4  -  [Key_SMD_12x12x7.3]  72.39 8 180 top
U3  CP2102N-A02-GQFN24R  [QFN-24_L4.0-W4.0-P0.50-TL-EP2.6]  16.88 23.51 0 top
U5  SHT20-TR-1.5KS  [DFN-6_L3.0-W3.0-P0.95-TR-EP]  8.13 37.72 90 top
U6  SGP40-D-R4  [DFN-6_L2.4-W2.4-P0.80-TL-EP]  7.75 41.35 0 top
U10  GD32F303CBT6  [LQFP-48_L7.0-W7.0-P0.50-LS9.0-BL]  43.56 23.5 270 top
U11  WT588D-20SS  [SSOP-20_L7.2-W5.3-P0.65-LS7.8-BL]  72.26 18.8 90 top
U12  W25Q32JVSSIQ  [SOIC-8_L5.3-W5.3-P1.27-LS8.0-BL]  88.14 12.57 180 top
U13  -  [SOP_BCON]  85.92 32.81 0 top
U15  SL6206-33MR  [SOT-23-5_L2.9-W1.6-P0.95-LS2.8-BL]  83.94 27.85 180 top
U16  M24C02-WMN6TP  [SOIC-8_L4.9-W3.9-P1.27-LS6.0-BL]  7.75 32.77 270 top
USB1  -  [USB_TYPE-C-16P]  5 24 270 top
X1  32.768kHz  [FC-135R_L3.2-W1.5]  25.85 25.87 270 top

## Footprints (pads in the part's own frame, mm; a bottom-side part is the same pattern mirrored in y, then rotated)
AO3401A_SOT-23-3
  rect 1x0.8 smd: 1(1.15,-0.95) 2(1.15,0.95) 3(-1.15,0)
BAT-SMD_BS-12-B3AA011
  rect 3.75x2.8 smd: 1(7.75,0)
  rect 4.4x2.8 smd: 2(-7.75,0)
C0805
  rect 1.41x1.35 smd: 1(-1,0) 2(1,0)
C1206
  rect 1.485x1.728 smd: 1(-1.593,0) 2(1.593,0)
CONN-TH_2P-P2.50_HX25003-2A
  rect 1.8x1.8 hole 1.1: 1(-1.25,0)
  round 1.8 hole 1.1: 2(1.25,0)
DFN-6_L2.4-W2.4-P0.80-TL-EP
  rect 0.585x0.448 smd: 1(-1.137,0.8) 2(-1.137,0) 3(-1.137,-0.8) 4(1.137,-0.8) 5(1.137,0) 6(1.137,0.8)
  rect 1.25x1.65 smd: 7(0,0)
DFN-6_L3.0-W3.0-P0.95-TR-EP
  rect 0.5x0.75 smd: 1(0.95,1.452) 2(0,1.451) 3(-0.95,1.45) 4(-0.95,-1.452) 5(0,-1.452) 6(0.95,-1.451)
  rect 2.3x1.5 smd: 7(0.004,-0.001)
FC-135R_L3.2-W1.5
  rect 1x1.8 smd: 1(-1.25,0) 2(1.25,0)
HDR-TH_3P-P2.54-V-M-A
  rect 1.7x1.7 hole 1.1: 1(-2.54,0)
  round 1.7 hole 1.1: 2(0,0) 3(2.54,0)
HDR-TH_4P-P2.54-V-F
  rect 1.7x1.7 hole 1.1: 1(-3.81,0)
  round 1.7 hole 1.1: 2(-1.27,0) 3(1.27,0) 4(3.81,0)
HDR-TH_6P-P2.54-V-F
  rect 1.8x1.6 hole 1.02: 1(-6.35,0)
  round 1.6 hole 1.02: 2(-3.81,0) 3(-1.27,0) 4(1.27,0) 5(3.81,0) 6(6.35,0)
Key_SMD_12x12x7.3
  rect 2.999x1.999 smd: 1(-7.5,-2.499) 2(7.5,-2.499) 3(7.5,2.499) 4(-7.5,2.499)
LED-SEG-TH_FJ5461AH
  round 1.55 hole 0.9: 1(-6.35,-7.62) 2(-3.81,-7.62) 3(-1.27,-7.62) 4(1.27,-7.62) 5(3.81,-7.62) 6(6.35,-7.62) 7(6.35,7.62) 8(3.81,7.62) 9(1.27,7.62) 10(-1.27,7.62) 11(-3.81,7.62) 12(-6.35,7.62)
LED-SMD_4P-L2.0-W1.3-BR
  rect 0.55x0.55 smd: 1(0.775,-0.4) 2(-0.775,-0.4) 3(0.775,0.4) 4(-0.775,0.4)
LED_0805
  rect 1x1.25 smd: 1(-1.15,0.005) 2(1.05,0.005)
LQFP-48_L7.0-W7.0-P0.50-LS9.0-BL
  oval 0.27x1.5 smd: 1(-2.75,-4.25) 2(-2.25,-4.25) 3(-1.75,-4.25) 4(-1.25,-4.25) 5(-0.75,-4.25) 6(-0.25,-4.25) 7(0.25,-4.25) 8(0.75,-4.25) 9(1.25,-4.25) 10(1.75,-4.25) 11(2.25,-4.25) 12(2.75,-4.25) 25(2.75,4.25) 26(2.25,4.25) 27(1.75,4.25) 28(1.25,4.25) 29(0.75,4.25) 30(0.25,4.25) 31(-0.25,4.25) 32(-0.75,4.25) 33(-1.25,4.25) 34(-1.75,4.25) 35(-2.25,4.25) 36(-2.75,4.25)
  oval 1.5x0.27 smd: 13(4.25,-2.75) 14(4.25,-2.25) 15(4.25,-1.75) 16(4.25,-1.25) 17(4.25,-0.75) 18(4.25,-0.25) 19(4.25,0.25) 20(4.25,0.75) 21(4.25,1.25) 22(4.25,1.75) 23(4.25,2.25) 24(4.25,2.75) 37(-4.25,2.75) 38(-4.25,2.25) 39(-4.25,1.75) 40(-4.25,1.25) 41(-4.25,0.75) 42(-4.25,0.25) 43(-4.25,-0.25) 44(-4.25,-0.75) 45(-4.25,-1.25) 46(-4.25,-1.75) 47(-4.25,-2.25) 48(-4.25,-2.75)
M2螺丝
  round 2 hole 2: 1(0,0)
QFN-24_L4.0-W4.0-P0.50-TL-EP2.6
  oval 0.8x0.28 smd: 1(-2,1.25) 2(-2,0.75) 3(-2,0.25) 4(-2,-0.25) 5(-2,-0.75) 6(-2,-1.25) 13(2,-1.25) 14(2,-0.75) 15(2,-0.25) 16(2,0.25) 17(2,0.75) 18(2,1.242)
  oval 0.28x0.8 smd: 7(-1.25,-2) 8(-0.75,-2) 9(-0.25,-2) 10(0.25,-2) 11(0.75,-2) 12(1.25,-2) 19(1.25,2) 20(0.75,2) 21(0.25,2) 22(-0.25,2) 23(-0.75,2) 24(-1.25,2)
  rect 2.7x2.7 smd: 25(0,-0.013)
R0805
  rect 1.133x1.377 smd: 1(-1,0) 2(1,0)
RES-TH_L5.1-W4.3-P3.40-D0.5
  round 1.524 hole 0.762: 1(0,1.7) 2(0,-1.7)
S8550P_SOT
  rect 1.25x0.701 smd: 1(1.292,-0.95) 2(1.292,0.95) 3(-1.208,0)
SOIC-8_L4.9-W3.9-P1.27-LS6.0-BL
  oval 0.588x2.045 smd: 1(-1.905,-2.772) 2(-0.635,-2.772) 3(0.635,-2.772) 4(1.905,-2.772) 5(1.905,2.772) 6(0.635,2.772) 7(-0.635,2.772) 8(-1.905,2.772)
SOIC-8_L5.3-W5.3-P1.27-LS8.0-BL
  oval 0.63x2.25 smd: 1(-1.905,-3.53) 2(-0.635,-3.53) 3(0.635,-3.53) 4(1.905,-3.53) 5(1.905,3.53) 6(0.635,3.53) 7(-0.635,3.53) 8(-1.905,3.53)
SOP_BCON
  oval 1.2x0.5 smd: 1(0,1.8) 2(0,0.9) 3(0,0) 4(2,0) 5(2,1.8)
SOT-23-5_L2.9-W1.6-P0.95-LS2.8-BL
  rect 0.6x1 smd: 1(-0.95,-1.1) 2(0,-1.1) 3(0.95,-1.1) 4(0.95,1.1) 5(-0.95,1.1)
SPK-TH_BD23.0-P10.00-D0.8-L-RD
  rect 2.5x2.5 hole 1.1: 1(-5,0)
  round 2.5 hole 1.1: 2(5,0)
SSOP-20_L7.2-W5.3-P0.65-LS7.8-BL
  oval 0.364x2.082 smd: 1(-2.925,-3.491) 2(-2.275,-3.491) 3(-1.625,-3.491) 4(-0.975,-3.491) 5(-0.325,-3.491) 6(0.325,-3.491) 7(0.975,-3.491) 8(1.625,-3.491) 9(2.275,-3.491) 10(2.925,-3.491) 11(2.925,3.491) 12(2.275,3.491) 13(1.625,3.491) 14(0.975,3.491) 15(0.325,3.491) 16(-0.325,3.491) 17(-0.975,3.491) 18(-1.625,3.491) 19(-2.275,3.491) 20(-2.925,3.491)
USB_TYPE-C-16P
  oval 1.2x2 hole 0.7x1.7: 1(-4.193,1.765) 2(4.447,1.765)
  oval 1.2x1.8 hole 0.7x1.4: 3(-4.193,-2.415) 4(4.447,-2.415)
  rect 0.3x1.3 smd: A1(-3.223,2.415) A4(-2.423,2.415) A5(-1.123,2.415) A6(-0.123,2.415) A7(0.377,2.415) A8(1.377,2.415) A9(2.677,2.415) A12(3.477,2.415) B1(3.177,2.415) B4(2.377,2.415) B5(1.877,2.415) B6(0.877,2.415) B7(-0.623,2.415) B8(-1.623,2.415) B9(-2.123,2.415) B12(-2.923,2.415)

## Nets
As in the schematic.

Pads without a net: U3 1 10 11 12 13 14 15 16 17 18 19 22 23 24; U5 3 4; U6 4; U10 2 5 6; U11 6 20; U15 4; USB1 A8 B8

## Via types
v1: diameter 0.61, hole 0.305, Top Layer to Bottom Layer, 392 vias
v2: diameter 0.635, hole 0.381, Top Layer to Bottom Layer, 21 vias

## Routing (per net, layer and track width the routed paths; a pad name or vN(x,y) marks a point on that pad's centre or on a via; arc(x,y) is an arc through that point)
+3V3: length 379.6
  Top Layer w0.254: 57.42,38.28 57.34,38.19 Q4.2 ; 57.42,38.28 53.2,38.28 53.02,38.1 Q5.2 53.05,37.17 R31.1 53.05,29.94 52.58,29.46 48.64,29.46 48.02,28.84 C30.1 47.81,27.35 U10.36 47.77,26.29 45.58,26.29 ; 57.42,38.28 60.71,38.28 ; U16.8 12.78,34.67 C23.1 ; v1(89.41,22.86) 89.4,22.87 C17.2 84.86,23.99 84.89,24.02 U15.5 84.64,27.01 84,27.01 82.94,28.07 80.26,28.07 79.12,29.21 v1(75.82,29.21) 67.94,29.21 67.24,29.91 Q1.2 67.24,37.96 66.93,38.28 63.94,38.28 ; Q3.2 60.64,38.21 60.71,38.28 ; C31.2 40.73,27.83 U10.48 40.81,26.75 41.28,26.29 45.58,26.29 ; C28.1 48.06,18.76 48.06,17.71 47.88,17.53 46.61,17.53 46.31,17.82 U10.24 46.31,20.23 46.15,20.38 46.16,20.52 45.72,20.95 45.72,26.15 45.58,26.29 ; C23.1 14.14,34.58 v1(14.22,34.67) ; C23.1 12.87,36.02 R30.2 ; H1.5 83.69,3.05 83.31,3.43 49.02,3.43 48.39,4.06 48.39,7.49 47.88,8 R16.1 ; R34.1 97.16,16 v1(96.52,16.64) ; v1(23.24,19.05) 27.94,19.05 28.17,19.28 C29.2 30.64,20.43 R13.1 31.37,20.32 v1(32.13,21.08) ; R23.2 39.77,14.72 39.5,14.99 v1(37.85,14.99) ; v1(84.33,17.14) 81.41,17.14 79.59,15.33 C7.1 75.76,12.77 75.44,12.45 75.44,8.76 75.95,8.25 84.2,8.25 84.58,8.64 84.58,10.54 85.22,11.18 v1(88.74,11.18) ; C4.2 75.84,24.83 75.75,24.74 U11.10 77.21,21.72 77.72,21.21 v1(77.72,20.25) 77.72,18.8 77.4,18.47 U11.5 72.95,18.47 72.3,17.82 65.95,17.82 64.9,16.77 R17.1 64.7,15.13 R12.2 ; R29.2 1.18,37.81 0.89,38.1 v1(0.89,38.99) 0.89,48.64 1.14,48.89 H3.3 ; 63.94,38.28 63.94,38.27 Q2.2 ; 63.94,38.28 60.71,38.28 ; C6.2 88.77,6.75 U12.7 88.77,11.14 v1(88.74,11.18) ; v1(88.74,11.18) 89.66,11.18 90.04,10.79 U12.8 ; v1(96.65,18.67) 96.65,22.1 97.16,22.61 H2.2 ; R15.1 23.1,14.73 R14.1 20.83,14.75 v1(20.83,16.13) ; v1(14.22,18.13) 14.22,17.27 14.48,17.02 15.62,17.02 16,17.4 v1(16,17.91)
  Bottom Layer w0.254: v1(14.22,20.45) v1(14.22,34.67) 14.22,35.69 13.97,35.94 1.27,35.94 0.89,36.32 v1(0.89,38.99) ; v1(47.62,8) 47.62,14.22 46.86,14.99 v1(37.85,14.99) 36.7,16.13 22.99,16.13 ; v1(16,17.91) 20.57,17.91 20.83,17.65 v1(20.83,16.13) 22.99,16.13 ; v1(84.33,17.14) 84.33,22.73 84.58,22.99 89.28,22.99 v1(89.41,22.86) 89.41,19.43 90.04,18.8 96.52,18.8 v1(96.65,18.67) 96.52,18.54 v1(96.52,16.64) ; 22.99,16.13 23.24,16.38 v1(23.24,19.05) ; v1(75.82,29.21) 75.82,21.97 76.07,21.72 77.34,21.72 77.72,21.34 v1(77.72,20.25) ; v1(32.13,21.08) 32.13,28.96 32.51,29.34 37.72,29.34 37.97,29.08 37.97,28.19 38.35,27.81 v1(39.62,27.81)
  vias: v1(14.22,19.07)
GND: length 117.1
  Top Layer w0.254: 73.91,27.05 69.34,27.05 v1(69.22,26.92) ; 73.91,27.05 73.8,26.94 C1.2 73.8,23.71 R11.2 ; 73.91,27.05 77.34,27.05 77.84,26.55 C4.1 77.84,23.81 C5.1 ; C24.1 13.9,42.97 C26.1 ; C8.2 21.21,12.3 v1(21.21,11.05) ; U11.19 v1(66.81,16.52) 66.68,16.38 ; U6.2 U6.7 v1(7.75,39.73) 7.75,38.1 U5.7 ; U16.1 U16.3 U16.4 v1(3.05,30.86) ; C22.1 30.03,23.35 29.2,22.52 C21.1 26.84,22.52 26.17,21.85 C29.1 ; R35.2 95.24,8.27 95,8.51 ; R22.2 31.43,39.18 v1(30.73,39.88) ; v1(51.56,27.56) C30.2 50.02,26.27 49.49,25.75 U10.35 ; C20.1 26.58,28.79 v1(26.29,29.08) ; v1(91.44,8.51) 90.79,7.86 C6.1 ; U10.47 41.31,28.67 40.77,29.21 36.07,29.21 35.89,29.03 35.89,27.86 C31.1 33.89,27.83 v1(33.78,27.94) ; C25.1 4.78,44.18 C27.1 ; U10.23 v1(45.81,16.26) ; C13.2 91.44,34.29 91.19,34.54 R18.1 ; v1(85.34,14.61) 85.98,14.61 86.23,14.86 U12.4 ; C28.2 v1(51.94,18.8) ; C10.2 39.74,5.78 SW2.4 ; 68.77,19.12 66.62,19.12 v1(66.42,18.92) ; v1(40.89,22.22) 40.37,22.75 U10.8 ; C9.2 27.8,14.72 v1(27.81,14.73) ; BT1.2 v1(22.1,54.99) 22.22,55.12 ; v1(81.67,21.34) C17.1 81.67,25.03 81.79,25.15 C18.1 ; C11.2 60.22,13.15 C2.2 v1(57.91,14.9) ; 90.42,25.53 v1(90.35,25.6) C15.1 88.79,26.51 88.52,26.79 C16.1 86.54,26.82 86.54,27.51 86.36,27.69 84.2,27.69 83.94,27.95 U15.2 ; USB1.B12 v1(8.89,26.92)
  Bottom Layer w0.254: v1(6.6,15.11) 6.6,16.05 10.69,20.13 v1(10.81,20.13)
  vias: v1(0.91,23.87) v1(2.03,22.22) v1(2.16,16.26) v1(2.16,15.49) v1(2.16,14.73) v1(2.89,33.4) v1(2.89,26.12) v1(2.96,16.26) v1(3,15.49) v1(2.95,14.73) v1(4.57,48.13) v1(5.08,56.01) v1(5.72,54.61) v1(6.1,45.72) v1(6.98,43.56) v1(7.37,5.84) v1(7.37,5.08) v1(7.37,4.32) v1(8.17,5.84) v1(8.21,5.08) v1(8.16,4.32) v1(8.47,43.56) v1(9.02,48.39) v1(9.02,47.59) v1(9.78,48.43) v1(9.78,47.59) v1(10.03,43.43) v1(10.54,48.38) v1(10.54,47.59) v1(10.67,12.7) v1(10.67,11.9) v1(11.43,12.74) v1(11.43,11.9) v1(12.19,12.69) v1(12.19,11.9) v1(12.95,26.67) v1(13.21,28.96) v1(14.61,5.59) v1(14.61,4.83) v1(14.61,4.06) v1(15.41,5.59) v1(15.45,4.83) v1(15.4,4.06) v1(15.84,36.96) v1(15.84,36.19) v1(15.84,35.43) v1(16.64,36.96) v1(16.63,35.43) v1(16.68,36.19) v1(16.89,28.96) v1(17.78,43.44) v1(17.78,42.63) v1(18.54,43.47) v1(18.54,42.63) v1(19.3,43.43) v1(19.3,42.63) v1(19.3,19.69) v1(20.07,29.59) v1(20.92,36.7) v1(20.92,35.94) v1(20.92,35.18) v1(20.95,3.22) v1(20.95,2.41) v1(21.72,36.7) v1(21.71,35.18) v1(21.72,3.25) v1(21.72,2.41) v1(21.76,35.94) v1(21.97,46.36) v1(21.97,45.59) v1(21.97,44.83) v1(22.31,28.7) v1(22.31,27.94) v1(22.31,27.18) v1(22.48,3.21) v1(22.48,2.41) v1(22.55,7.87) v1(22.77,46.36) v1(22.81,45.59) v1(22.76,44.83) v1(23.12,28.7) v1(23.11,27.18) v1(23.24,57.91) v1(23.15,27.94) v1(23.88,22.48) v1(24.85,36.7) v1(24.85,35.94) v1(24.85,35.18) v1(25.65,35.18) v1(25.66,36.7) v1(25.69,35.94) v1(26.88,57.53) v1(26.88,56.77) v1(26.88,56.01) v1(27.05,45.34) v1(27.56,6.35) v1(27.56,5.59) v1(27.56,4.83) v1(27.69,57.53) v1(27.73,56.77) v1(27.68,56.01) v1(28.16,52.29) v1(28.36,6.35) v1(28.4,5.59) v1(28.35,4.83) v1(30.37,34.42) v1(30.99,28.83) v1(30.99,11.91) v1(31.37,48.39) v1(31.37,43.05) v1(31.58,58.04) v1(31.58,57.28) v1(31.58,56.52) v1(32.39,58.04) v1(32.42,57.28) v1(32.38,56.52) v1(32.77,34.42) v1(33.27,30.86) v1(33.64,27.12) v1(33.66,11.68) v1(34.75,30.86) v1(34.85,34.42) v1(36.19,19.94) v1(36.19,6.1) v1(36.19,5.33) v1(36.19,4.57) v1(36.81,30.86) v1(36.9,34.41) v1(37.04,58.04) v1(37.04,57.28) v1(37.04,56.52) v1(37,6.1) v1(37.04,5.33) v1(36.99,4.57) v1(37.21,48.64) v1(37.85,58.04) v1(37.84,56.52) v1(37.89,57.28) v1(38.23,16.76) v1(38.64,19.94) v1(39.12,34.67) v1(39.24,30.35) v1(39.37,51.31) v1(41.66,3.34) v1(41.66,2.54) v1(42.42,3.38) v1(42.42,2.54) v1(43.18,3.33) v1(43.18,2.54) v1(44.07,23.88) v1(44.45,24.89) v1(45.7,34.29) v1(47.24,56.01) v1(47.5,58.8) v1(47.75,31.75) v1(48.26,34.29) v1(49.24,49.95) v1(49.24,49.15) v1(50,49.99) v1(50,49.15) v1(50.16,31.62) v1(50.16,5.33) v1(50.29,58.93) v1(50.29,55.75) v1(50.76,49.94) v1(50.76,49.15) v1(51.94,30.61) v1(52.07,13.08) v1(52.07,12.28) v1(52.83,13.12) v1(52.83,12.28) v1(53.47,28.19) v1(53.47,27.43) v1(53.47,26.67) v1(53.47,18.29) v1(53.47,17.53) v1(53.47,16.76) v1(53.59,13.07) v1(53.59,12.28) v1(54.1,5.63) v1(54.1,4.83) v1(54.27,28.19) v1(54.31,27.43) v1(54.26,26.67) v1(54.27,18.29) v1(54.31,17.53) v1(54.26,16.76) v1(54.86,5.67) v1(54.86,4.83) v1(55.25,56.26) v1(55.63,5.62) v1(55.63,4.83) v1(56.26,48.39) v1(56.26,27.05) v1(56.27,8) v1(57.28,30.61) v1(57.53,18.29) v1(60.03,58.42) v1(60.03,57.66) v1(60.03,56.9) v1(60.45,30.35) v1(60.45,27.28) v1(60.83,58.42) v1(60.82,56.9) v1(60.87,57.66) v1(61,48.64) v1(61.59,42.55) v1(61.72,19.43) v1(61.72,2.58) v1(61.72,1.78) v1(62.48,2.62) v1(62.48,1.78) v1(63.25,8.25) v1(63.25,2.57) v1(63.25,1.78) v1(63.5,30.86) v1(64.01,27.18) v1(64.39,43.31) v1(67.31,15.24) v1(68.33,24.13) v1(68.33,9.15) v1(68.33,8.34) v1(68.58,56.26) v1(68.58,12.87) v1(68.58,12.06) v1(69.09,9.18) v1(69.09,8.34) v1(69.09,5.76) v1(69.09,4.95) v1(69.34,12.91) v1(69.34,12.06) v1(69.85,9.14) v1(69.85,8.34) v1(69.85,5.79) v1(69.85,4.95) v1(70.1,12.86) v1(70.1,12.06) v1(70.36,31.5) v1(70.61,5.75) v1(70.61,4.95) v1(70.99,41.66) v1(71.88,31.88) v1(72.26,46.61) v1(72.39,12.6) v1(73.91,57.02) v1(74.29,30.99) v1(75.31,6.01) v1(75.31,5.21) v1(76.07,6.05) v1(76.07,5.21) v1(76.84,6) v1(76.84,5.21) v1(76.96,31.62) v1(77.98,39.88) v1(78.1,14.86) v1(78.23,33.15) v1(79.08,47.12) v1(79.08,46.36) v1(79.08,45.59) v1(79.88,47.12) v1(79.92,46.36) v1(79.88,45.59) v1(82.04,15.92) v1(82.04,15.11) v1(82.68,31.75) v1(82.68,10.92) v1(82.68,10.16) v1(82.68,9.4) v1(82.8,15.95) v1(82.8,15.11) v1(82.93,5.08) v1(83.48,10.92) v1(83.52,10.16) v1(83.47,9.4) v1(83.57,15.91) v1(83.57,15.11) v1(87.5,21.08) v1(89.03,5.08) v1(89.03,4.28) v1(89.79,5.12) v1(89.79,4.28) v1(90.55,5.07) v1(90.55,4.28) v1(91.27,56.13) v1(91.27,55.37) v1(91.27,54.61) v1(91.65,26.67) v1(91.65,25.91) v1(91.65,25.15) v1(92.08,56.13) v1(92.11,55.37) v1(92.07,54.61) v1(92.33,35.31) v1(92.45,25.15) v1(92.46,26.67) v1(92.5,25.91) v1(93.09,21.21) v1(93.09,15.62) v1(93.09,14.82) v1(93.85,15.66) v1(93.85,14.82) v1(94.62,15.61) v1(94.62,14.82) v1(95.11,8.67) v1(98.13,39.12) v1(98.13,38.35) v1(98.13,37.59) v1(98.93,39.12) v1(98.93,37.59) v1(98.97,38.35)
VBAT: length 3.9
  Top Layer w0.254: U15.3 82.99,30.03 83.19,30.23 v1(85.72,30.23)
VBUS: length 131.7
  Top Layer w0.254: 15.63,19.3 15.63,19.31 U3.7 ; 15.63,19.3 16.13,19.3 U3.8 ; 15.63,19.3 15.63,18.93 v1(15.24,18.54) ; USB1.B9 6.56,26.12 6.22,25.78 4.95,25.78 4.77,25.6 4.77,22.56 5.11,22.22 5.97,22.22 6.57,21.62 USB1.B4 7.61,21.43 v2(8.45,21.43) 8.45,16.06 8.89,15.62 v1(15.24,15.62) ; C14.2 71.46,35 71.5,35.04 ; 71.5,35.04 R19.1 ; 71.5,35.04 v1(71.5,33.27) ; 87.92,31.01 v1(89.15,31.01)
  Bottom Layer w0.254: v1(15.24,15.62) v1(15.24,18.54) 15.24,30.99 16.76,32.51 70.74,32.51 v1(71.5,33.27) 71.5,35.81 72.01,36.32 88.65,36.32 89.15,35.81 v1(89.15,31.01)
+VS: length 85.5
  Top Layer w0.254: C24.2 12.89,40.97 12.94,41.02 v2(15.88,41.02) ; v2(10.41,37.72) U5.5 ; v2(15.88,41.02) v1(32.26,41.02) ; v2(15.88,41.02) 16.13,41.28 16.13,46.1 15.75,46.48 1.65,46.48 1.4,46.23 1.4,40.26 1.65,40 R28.1 ; v1(9.65,41.28) 8.97,41.28 U6.5 ; v1(52.07,40.89) Q5.3
  Bottom Layer w0.254: v2(10.41,37.72) 10.03,37.72 9.65,38.1 v1(9.65,41.28) 15.62,41.28 v2(15.88,41.02) ; v1(32.26,41.02) 32.26,38.86 32.64,38.48 49.4,38.48 49.78,38.86 49.78,40.51 50.16,40.89 v1(52.07,40.89)
AM_BUSY: length 21.4
  Top Layer w0.254: U11.11 67.19,21.72 67.18,21.72 66.93,21.72 65.9,22.75 U10.29
AM_CLK: length 28.2
  Top Layer w0.254: v2(73.15,21.46) 73.53,21.08 75.74,21.08 U11.9 ; U10.26 47.85,21.28 65.57,21.28 v2(65.66,21.37)
  Bottom Layer w0.254: v2(73.15,21.46) 66.68,21.46 66.58,21.37 v2(65.66,21.37)
AM_CS: length 28.1
  Top Layer w0.254: U11.8 v2(73.15,20.42) ; U10.25 63.07,20.75 63.37,20.45 v2(67.06,20.45)
  Bottom Layer w0.254: v2(73.15,20.42) 73.13,20.45 v2(67.06,20.45)
AM_DAT: length 30.3
  Top Layer w0.254: v2(64.59,22.1) 64.45,22.25 U10.28 ; U11.7 73.49,19.77 v2(73.28,19.56)
  Bottom Layer w0.254: v2(73.28,19.56) 65.15,19.56 64.64,20.07 64.64,22.05 v2(64.59,22.1)
AM_RST: length 30
  Top Layer w0.254: U10.27 46.76,21.75 46.61,21.59 46.61,20.57 46.99,20.19 59.82,20.19 60.2,19.81 60.2,16.92 C2.1 60.44,17.13 R12.1 64.37,17.13 64.77,17.53 64.77,19.52 65.02,19.77 U11.14
COM1: length 26.4
  Top Layer w0.254: R24.1 65.33,24.05 64.55,23.28 47.85,23.28 U10.30
COM2: length 22.5
  Top Layer w0.254: R25.1 62.03,24.56 61.21,23.75 U10.31
COM3: length 18.8
  Top Layer w0.254: U10.32 58.03,24.25 58.72,24.94 R26.1
COM4: length 15
  Top Layer w0.254: R27.1 55.37,25.27 54.86,24.77 48.84,24.77 48.81,24.75 U10.33
I2C_SCL: length 57.5
  Top Layer w0.254: U10.45 42.32,27.75 42.32,28.36 42.31,28.37 42.31,30.08 41.99,30.4 40.7,30.4 39.56,31.55 31.69,31.55 29.73,33.5 29.73,38.34 29.06,39.01 12.39,39.01 R30.1 12.13,38.77 10.96,38.77 ; U16.6 8.76,32.13 8.64,32.26 8.64,35.56 8.89,35.81 10.8,35.81 11.06,36.08 11.06,38.66 10.96,38.77 ; 10.96,38.77 10.86,38.67 U5.6 ; 10.96,38.77 10.96,41.62 10.43,42.15 U6.6
I2C_SDA: length 57.7
  Top Layer w0.254: U6.3 6.68,40.49 U5.1 6.61,38.61 6.22,38.61 5.43,37.81 R29.1 4.53,35.77 4.06,35.31 2.03,35.31 1.78,35.05 1.78,29.84 2.16,29.46 7.24,29.46 8.64,30.86 U16.5 v1(28.7,30.86) ; U10.46 41.81,29.41 41.56,29.67 38.77,29.67 38.22,30.23 v1(31.37,30.23)
  Bottom Layer w0.254: v1(31.37,30.23) 30.73,30.86 v1(28.7,30.86)
KEY1: length 46.2
  Top Layer w0.254: SW1.2 SW1.1 18.93,11.63 18.94,11.63 C8.1 18.94,14.61 R14.2 18.81,16.53 19.3,17.02 32.64,17.02 32.89,17.27 32.89,21.46 33.15,21.72 39.24,21.72
KEY2: length 41.3
  Top Layer w0.254: C9.1 25.27,10.76 SW2.2 SW2.1 ; C9.1 R15.2 ; C9.1 32.53,12.72 33.53,13.72 33.53,20.95 33.82,21.25 U10.11
KEY3: length 44.7
  Top Layer w0.254: U10.12 34.72,20.75 34.29,20.32 34.29,13.21 35.38,12.12 41.81,12.12 41.99,11.94 41.99,9.23 41.74,8.98 C10.1 43.56,8.05 R16.2 43.61,8.94 45.08,10.41 SW3.2 SW3.1
KEY4: length 57.1
  Top Layer w0.254: v2(73.03,10.5) SW4.2 64.89,12.91 R17.2 62.44,12.92 C11.1 62.37,9.16 62.1,8.89 v1(48.51,8.89) ; v1(39.88,16.89) 40.64,16.89 40.81,17.06 U10.13 ; SW4.1 79.76,10.63 v2(76.96,10.63)
  Bottom Layer w0.254: v1(48.51,8.89) 48.51,15.88 47.5,16.89 v1(39.88,16.89) ; v2(73.03,10.5) 73.15,10.63 v2(76.96,10.63)
LED1: length 6.7
  Top Layer w0.254: LED2.1 43.03,13.61 42.8,13.84 42.8,16.64 41.81,17.62 U10.15
LED2: length 4.6
  Top Layer w0.254: LED2.2 43.55,16.65 42.29,17.91 42.29,19.22 U10.16
LED3: length 4.7
  Top Layer w0.254: U10.17 42.81,18.03 44.35,16.5 LED2.4
PWR_EN: length 14
  Top Layer w0.254: U10.38 45.81,29.68 46.35,30.23 50.42,30.23 51.05,30.86 R31.2 51.12,35.36 Q5.1
RES_PHOTO: length 83.5
  Top Layer w0.254: v1(35.94,14.35) 35.94,15.24 36.49,15.78 41.06,15.78 41.31,16.04 U10.14 ; R34.2 97.24,8.5 R35.1 v1(98.55,6.13)
  Bottom Layer w0.254: v1(98.55,6.13) 83.66,6.13 82.8,6.99 36.7,6.99 35.94,7.75 v1(35.94,14.35)
RXD: length 38.5
  Top Layer w0.254: U10.21 44.81,17.89 v1(44.7,17.78) ; U3.20 17.63,26.39 18.03,26.8 20.45,26.8 20.7,26.54 20.7,17.91 20.95,17.65 v1(31.5,17.65)
  Bottom Layer w0.254: v1(31.5,17.65) 31.62,17.78 v1(44.7,17.78)
SEGA: length 25
  Top Layer w0.254: U10.18 43.31,20.82 41.02,23.11 v1(41.02,25.65) ; v1(41.08,31.62) 41.08,32.07 40.69,32.46 34.09,32.46 33.73,32.82 R1.1
  Bottom Layer w0.254: v1(41.02,25.65) 41.02,31.56 v1(41.08,31.62)
SEGB: length 23.7
  Top Layer w0.254: U10.19 43.81,21.09 41.91,22.99 v1(41.91,25.4) ; R2.1 35.86,33.17 36.11,32.92 41.5,32.92 42.04,32.39 v1(42.04,31.88)
  Bottom Layer w0.254: v1(42.04,31.88) 42.04,25.53 v1(41.91,25.4)
SEGC: length 22
  Top Layer w0.254: v1(42.68,31.37) 42.68,32.76 42.06,33.38 38.38,33.38 38.02,33.74 R3.1 ; U10.20 44.31,21.35 42.93,22.73 v1(42.93,25.53)
  Bottom Layer w0.254: v1(42.93,25.53) 42.93,31.11 v1(42.68,31.37)
SEGD: length 11.8
  Top Layer w0.254: U10.39 45.31,30.2 45.97,30.86 48.77,30.86 49.02,31.11 R4.1
SEGDP: length 11.1
  Top Layer w0.254: U10.43 43.31,33.45 42.93,33.83 40.84,33.83 40.27,34.41 R8.1
SEGE: length 9.3
  Top Layer w0.254: U10.40 44.81,28.75 44.83,28.77 44.83,30.48 46.62,32.27 R5.1
SEGF: length 8.8
  Top Layer w0.254: U10.41 44.31,35.94 R6.1
SEGG: length 9.6
  Top Layer w0.254: U10.42 43.81,34.04 43.56,34.29 42.8,34.29 42.42,34.67 R7.1
SPI_CS_AM: length 34.2
  Top Layer w0.254: H1.1 93.85,13.46 93.34,13.97 90.55,13.97 90.04,14.48 U12.1 90.04,17.78 89.15,18.67 81.03,18.67 79.53,17.17 U11.3
SPI_MISO: length 35
  Top Layer w0.254: H1.2 91.31,4.44 91.64,4.77 92.71,4.77 92.89,4.95 92.89,13.28 92.71,13.46 89.15,13.46 88.77,13.84 U12.2 88.77,17.78 88.34,18.21 81.46,18.21 79.12,15.87 U11.1
SPI_MOSI: length 29.2
  Top Layer w0.254: U12.5 86.23,7.4 ; 86.23,7.4 86.2,7.37 75.31,7.37 74.17,8.51 74.17,16.51 74.18,16.52 U11.2 ; 86.23,7.4 H1.4
SPI_SCK: length 36.7
  Top Layer w0.254: v2(84.84,4.01) 73.97,4.01 73.71,4.27 73.71,17.2 74.33,17.82 75.75,17.82 ; U12.6 v2(87.5,4.04) 87.5,3.3 H1.3
  Bottom Layer w0.254: v2(84.84,4.01) 87.5,4.01
TXD: length 44.5
  Top Layer w0.254: U10.22 45.28,19.28 45.28,20.75 44.96,21.07 v1(44.96,22.61) ; 21.08,26.8 21.26,26.62 21.26,19.11 21.99,18.39 31.78,18.39 v1(32.26,18.86) ; U3.21 17.13,26.54 17.84,27.25 20.64,27.25 21.02,26.87
  Bottom Layer w0.254: v1(32.26,18.86) 44.77,18.86 44.96,19.05 v1(44.96,22.61)
USB_DN: length 13.6
  Top Layer w0.254: USB1.B7 5.83,24.62 5.59,24.38 5.59,23.88 v2(5.84,23.62) USB1.A7 ; U3.4 10.02,23.26 v2(9.65,23.62)
  Bottom Layer w0.254: v2(5.84,23.62) 9.65,23.62
USB_DP: length 10.4
  Top Layer w0.254: 8.77,24.12 8.89,24 8.89,23.24 8.77,23.12 USB1.B6 ; 8.77,24.12 USB1.A6 ; 8.77,24.12 9.16,24.51 12.95,24.51 13.71,23.76 U3.3
$1N1449: length 23.7
  Top Layer w0.254: Q3.3 59.69,53.09 58.93,53.85 v2(53.85,53.85) ; DS1.8 v1(53.81,55.88)
  Bottom Layer w0.254: v2(53.85,53.85) 53.81,53.89 v1(53.81,55.88)
$1N1467: length 6.5
  Top Layer w0.254: DS1.1 43.65,41.06 43.9,40.81 45.92,40.81 46.62,40.1 R5.2
$1N1471: length 6.4
  Top Layer w0.254: DS1.2 46.19,41.19 46.44,40.93 48.48,40.93 49.02,40.39 R4.2
$1N1475: length 18.6
  Top Layer w0.254: R8.2 40.27,44.84 41.15,45.72 v2(48.64,45.72) ; v2(48.64,43.69) 48.64,42.47 DS1.3
  Bottom Layer w0.254: v2(48.64,45.72) v2(48.64,43.69)
$1N1479: length 25.8
  Top Layer w0.254: DS1.4 51.18,42.47 v1(51.18,43.94) ; R3.2 38.02,46.02 38.99,46.99 v1(51.18,46.99)
  Bottom Layer w0.254: v1(51.18,46.99) v1(51.18,43.94)
$1N1483: length 20
  Top Layer w0.254: R7.2 42.42,44.58 42.91,45.07 52.84,45.07 53.81,44.11 DS1.5
$1N1487: length 34.4
  Top Layer w0.254: DS1.11 46.19,58.84 45.85,59.18 34.16,59.18 33.73,58.75 R1.2
$1N1491: length 39.3
  Top Layer w0.254: DS1.7 56.31,57.58 56.31,55.04 56.13,54.86 36.32,54.86 35.86,54.4 R2.2
$1N1495: length 32.5
  Top Layer w0.254: R6.2 44.83,38.47 v2(44.83,40) ; v1(48.64,59.18) 48.64,57.71 DS1.10
  Bottom Layer w0.254: v1(48.64,59.18) 48.39,59.44 41.91,59.44 41.28,58.8 41.28,50.93 41.78,50.42 43.81,50.42 44.83,49.4 v2(44.83,40)
$1N6161: length 7.3
  Top Layer w0.254: U11.12 70.22,21.07 70.49,21.34 70.49,25.4 70.83,25.75 C1.1
$1N6192: length 5.9
  Top Layer w0.254: U11.13 70.07,20.42 70.09,20.45 71.25,20.45 71.72,20.92 R11.1
$1N6375: length 42.6
  Top Layer w0.254: v2(80.77,32.89) 81.41,32.89 83.26,34.75 SPK1.1 ; U11.18 70.07,17.17 70.09,17.14 v1(71.12,17.14)
  Bottom Layer w0.254: v2(80.77,32.89) 80.77,18.92 78.87,17.02 78.61,17.02 78.49,17.14 v1(71.12,17.14)
$1N6384: length 50.5
  Top Layer w0.254: v2(79.88,31.75) 81.28,31.75 84.84,35.31 84.84,40.13 85.34,40.64 92.84,40.64 93.26,41.07 SPK1.2 ; v1(71.37,18.67) 71.18,18.47 U11.16
  Bottom Layer w0.254: v2(79.88,31.75) 79.88,18.92 79.5,18.54 71.5,18.54 v1(71.37,18.67)
$1N6917: length 8.9
  Top Layer w0.254: C7.2 86.94,12.77 87.5,13.33 U12.3
$1N7212: length 8.6
  Top Layer w0.254: R13.2 30.82,22.25 U10.9
$1N7925: length 14.2
  Top Layer w0.254: X1.1 27.94,27.12 C20.2 29.47,26.79 31.02,25.25 U10.3
$1N7930: length 13.6
  Top Layer w0.254: X1.2 28.17,24.62 C21.2 28.49,24.75 U10.4
$1N8028: length 18.8
  Top Layer w0.254: U10.44 42.78,27.78 42.78,28.55 42.77,28.56 42.77,30.27 42.18,30.86 40.89,30.86 39.75,32 31.88,32 31.3,32.58 31.3,36.19 R22.1
$1N8104: length 4.6
  Top Layer w0.254: LED2.3 44.35,12.6 44.07,12.32 42.54,12.32 41.77,13.1 R23.1
$1N8256: length 41.1
  Top Layer w0.254: DS1.12 43.51,57.48 v1(43.51,55.88) ; Q1.3 v1(66.29,52.83)
  Bottom Layer w0.254: v1(43.51,55.88) 43.51,53.01 43.69,52.83 v1(66.29,52.83)
$1N8335: length 32.3
  Top Layer w0.254: DS1.9 51.27,58.64 51.82,59.18 62.1,59.18 62.99,58.29 Q2.3
$1N8343: length 3.1
  Top Layer w0.254: Q4.3 56.39,42.34 DS1.6
$1N8477: length 2.2
  Top Layer w0.254: R24.2 65.34,34.65 Q1.1
$1N8481: length 2.3
  Top Layer w0.254: R25.2 62.04,34.52 Q2.1
$1N8485: length 2.3
  Top Layer w0.254: R26.2 58.74,34.58 Q3.1
$1N8489: length 2.3
  Top Layer w0.254: Q4.1 55.44,34.59 R27.2
$1N8598: length 3.7
  Top Layer w0.254: C22.2 35.79,23.25 U10.7
$1N9384: length 5.9
  Top Layer w0.254: C27.2 4.81,42.2 R28.2 ; C27.2 4.78,42.18 C25.2 ; C27.2 6.56,42.2 U6.1
$1N9794: length 59.3
  Top Layer w0.254: U10.37 46.31,29.04 v1(46.74,29.46) ; R32.1 92.38,23.16 91.82,22.61 91.82,21.21 90.68,20.07 80.9,20.07 80.39,20.57 80.39,26.42 78.61,28.19 66.8,28.19 v1(66.42,28.58)
  Bottom Layer w0.254: v1(66.42,28.58) 65.53,29.46 v1(46.74,29.46)
$1N9795: length 3.7
  Top Layer w0.254: H2.1 97.32,25.15 97.31,25.16 R32.2
$1N9824: length 56.4
  Top Layer w0.254: v1(50.29,25.53) 50.01,25.25 U10.34 ; v1(66.8,25.02) 66.8,27.31 67.06,27.56 78.36,27.56 79.63,26.29 79.63,20.57 80.66,19.54 R33.1
  Bottom Layer w0.254: v1(50.29,25.53) 66.29,25.53 v1(66.8,25.02)
$1N9825: length 3.6
  Top Layer w0.254: H2.4 97.32,17.53 97.31,17.54 R33.2
$1N10132: length 6.3
  Top Layer w0.254: H3.1 3.94,53.97 4.32,53.59 4.32,51.97 4.47,51.82 BT1.1
$1N10135: length 59.1
  Top Layer w0.254: v1(28.83,42.55) 28.83,48.13 27.81,49.15 4.44,49.15 H3.2 ; v1(28.7,37.08) 28.7,32.77 29.84,31.62 29.84,27.69 31.32,26.21 39.28,26.21 U10.1
  Bottom Layer w0.254: v1(28.7,37.08) 28.83,37.21 v1(28.83,42.55)
$2N394: length 5.2
  Top Layer w0.254: USB1.A5 10.64,25.12 11.05,25.53 R9.2
$2N397: length 3.4
  Top Layer w0.254: R10.2 10.8,22.14 7.44,22.14 USB1.B5
$2N1836: length 21.5
  Top Layer w0.254: U3.9 16.66,21.48 16.66,16.53 16.38,16.26 9.27,16.26 9.02,16.51 9.02,20.77 9.27,21.03 11.76,21.03 12.83,22.1 R21.1
$2N7002: length 12.3
  Top Layer w0.254: v1(79.63,35.17) LED4.2 78.22,35.21 78.22,37.5 ; v1(84.84,32.77) 85.87,32.77 85.92,32.81
  Bottom Layer w0.254: v1(84.84,32.77) 84.84,34.8 84.46,35.17 v1(79.63,35.17)
$2N7018: length 2.4
  Top Layer w0.254: 76.01,37.5 76,37.49 R20.2
$2N7022: length 2.3
  Top Layer w0.254: R19.2 75.97,35.17 LED4.1
$2N7090: length 1.7
  Top Layer w0.254: R18.2 87.92,34.53 87.92,32.81

## Copper pours and planes (outline as drawn; the poured copper is in the pictures)
+3V3 on Top Layer: 12.04,21.27 12.04,17.55 12.19,17.4 14.85,17.4 14.85,21.03 15.37,21.55 15.37,22.86 15.24,22.99 14.48,22.99 14.35,22.86 14.35,21.59 13.91,21.59 13.65,21.27
GND on Top Layer: -2.67,61.59 102.74,61.59 102.74,-2.54 -2.67,-2.54
GND on Bottom Layer: -7.37,65.02 107.44,65.02 107.44,-5.59 -7.37,-5.59
VBAT on Top Layer: 85.92,31.44 85.29,31.44 85.09,31.24 85.09,29.97 84.96,29.84 84.68,29.84 84.46,29.63 84.46,28.31 84.84,27.94 92.33,27.94 93.47,29.08 96.27,29.08 96.65,29.46 96.65,30.86 95.91,31.6 94.17,31.6 93.6,31.03 93.6,30.61 93.47,30.48 90.04,30.48 89.66,30.1 87.23,30.1 86.93,30.4 86.93,31.18 86.61,31.5 85.97,31.5

Small or netless copper shapes (teardrops, artwork), in the pictures only: 462 on Top Layer, 86 on Bottom Layer
